# EAGLE design tarjeta-v5 (EAGLE 6.4)
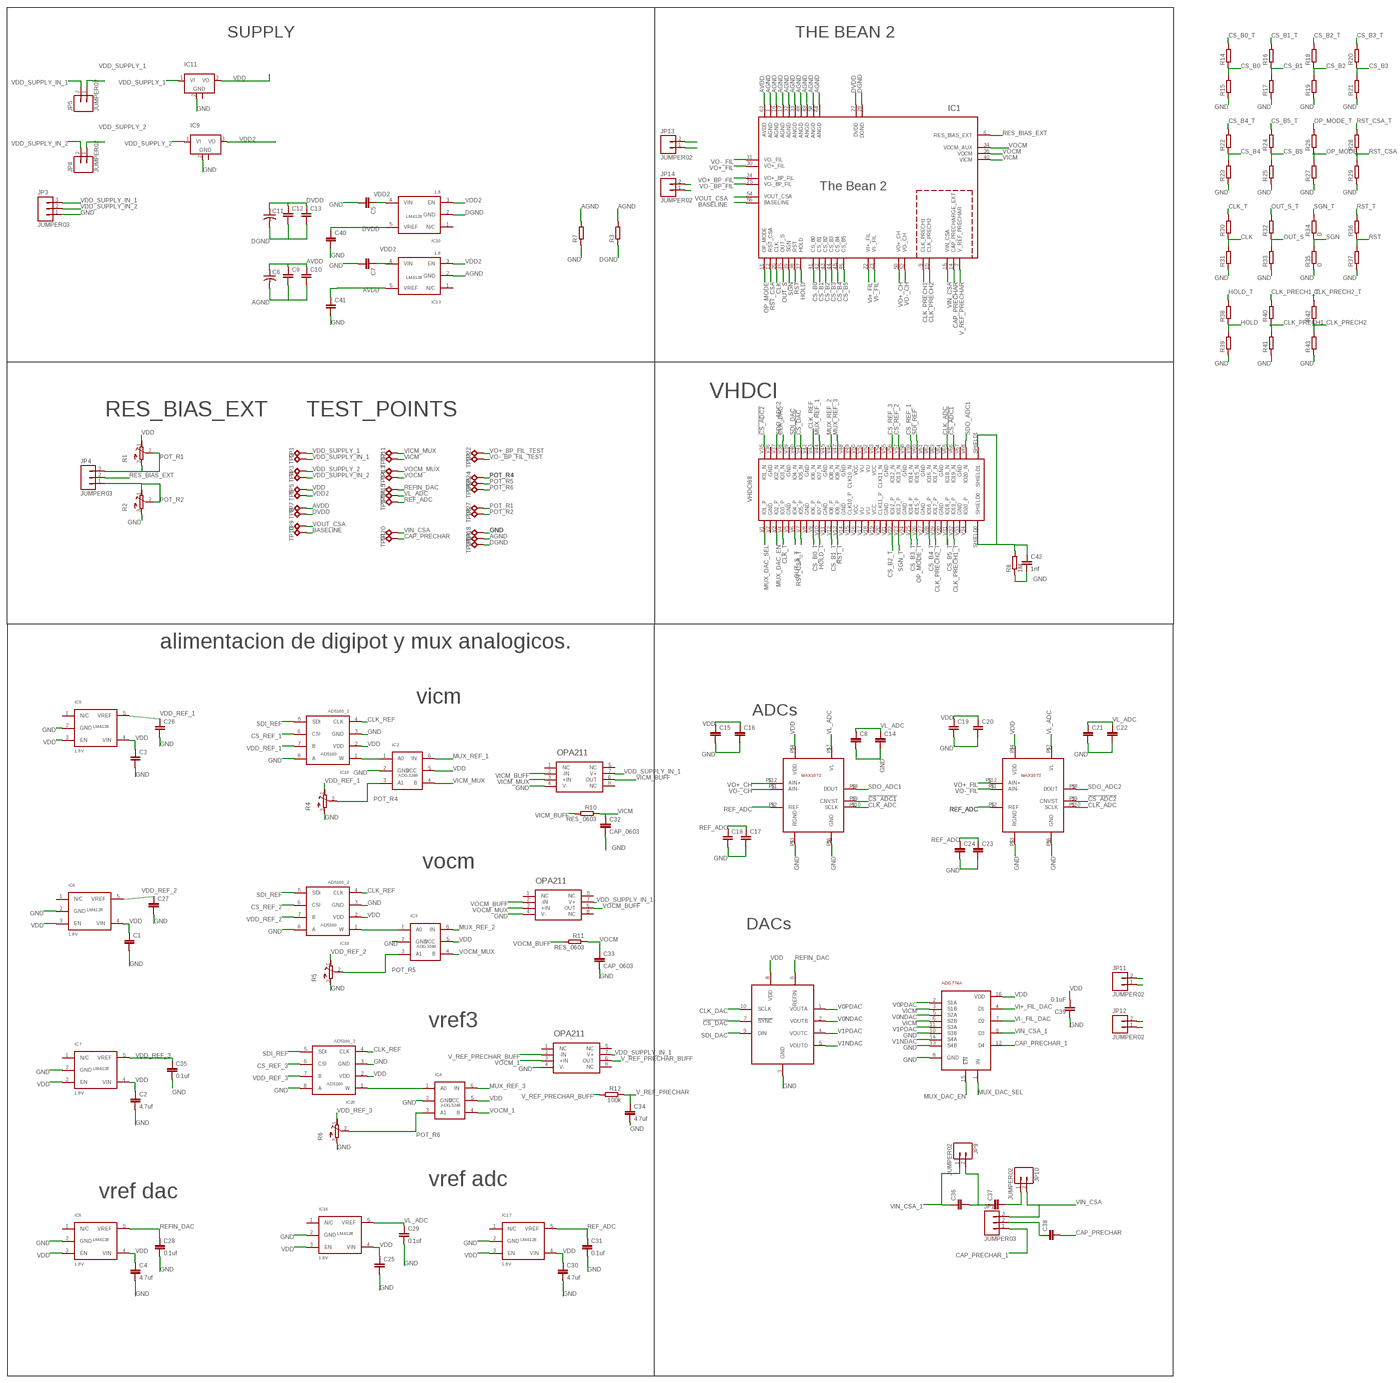
[diagram p0: schematic, sheet 1, overview]
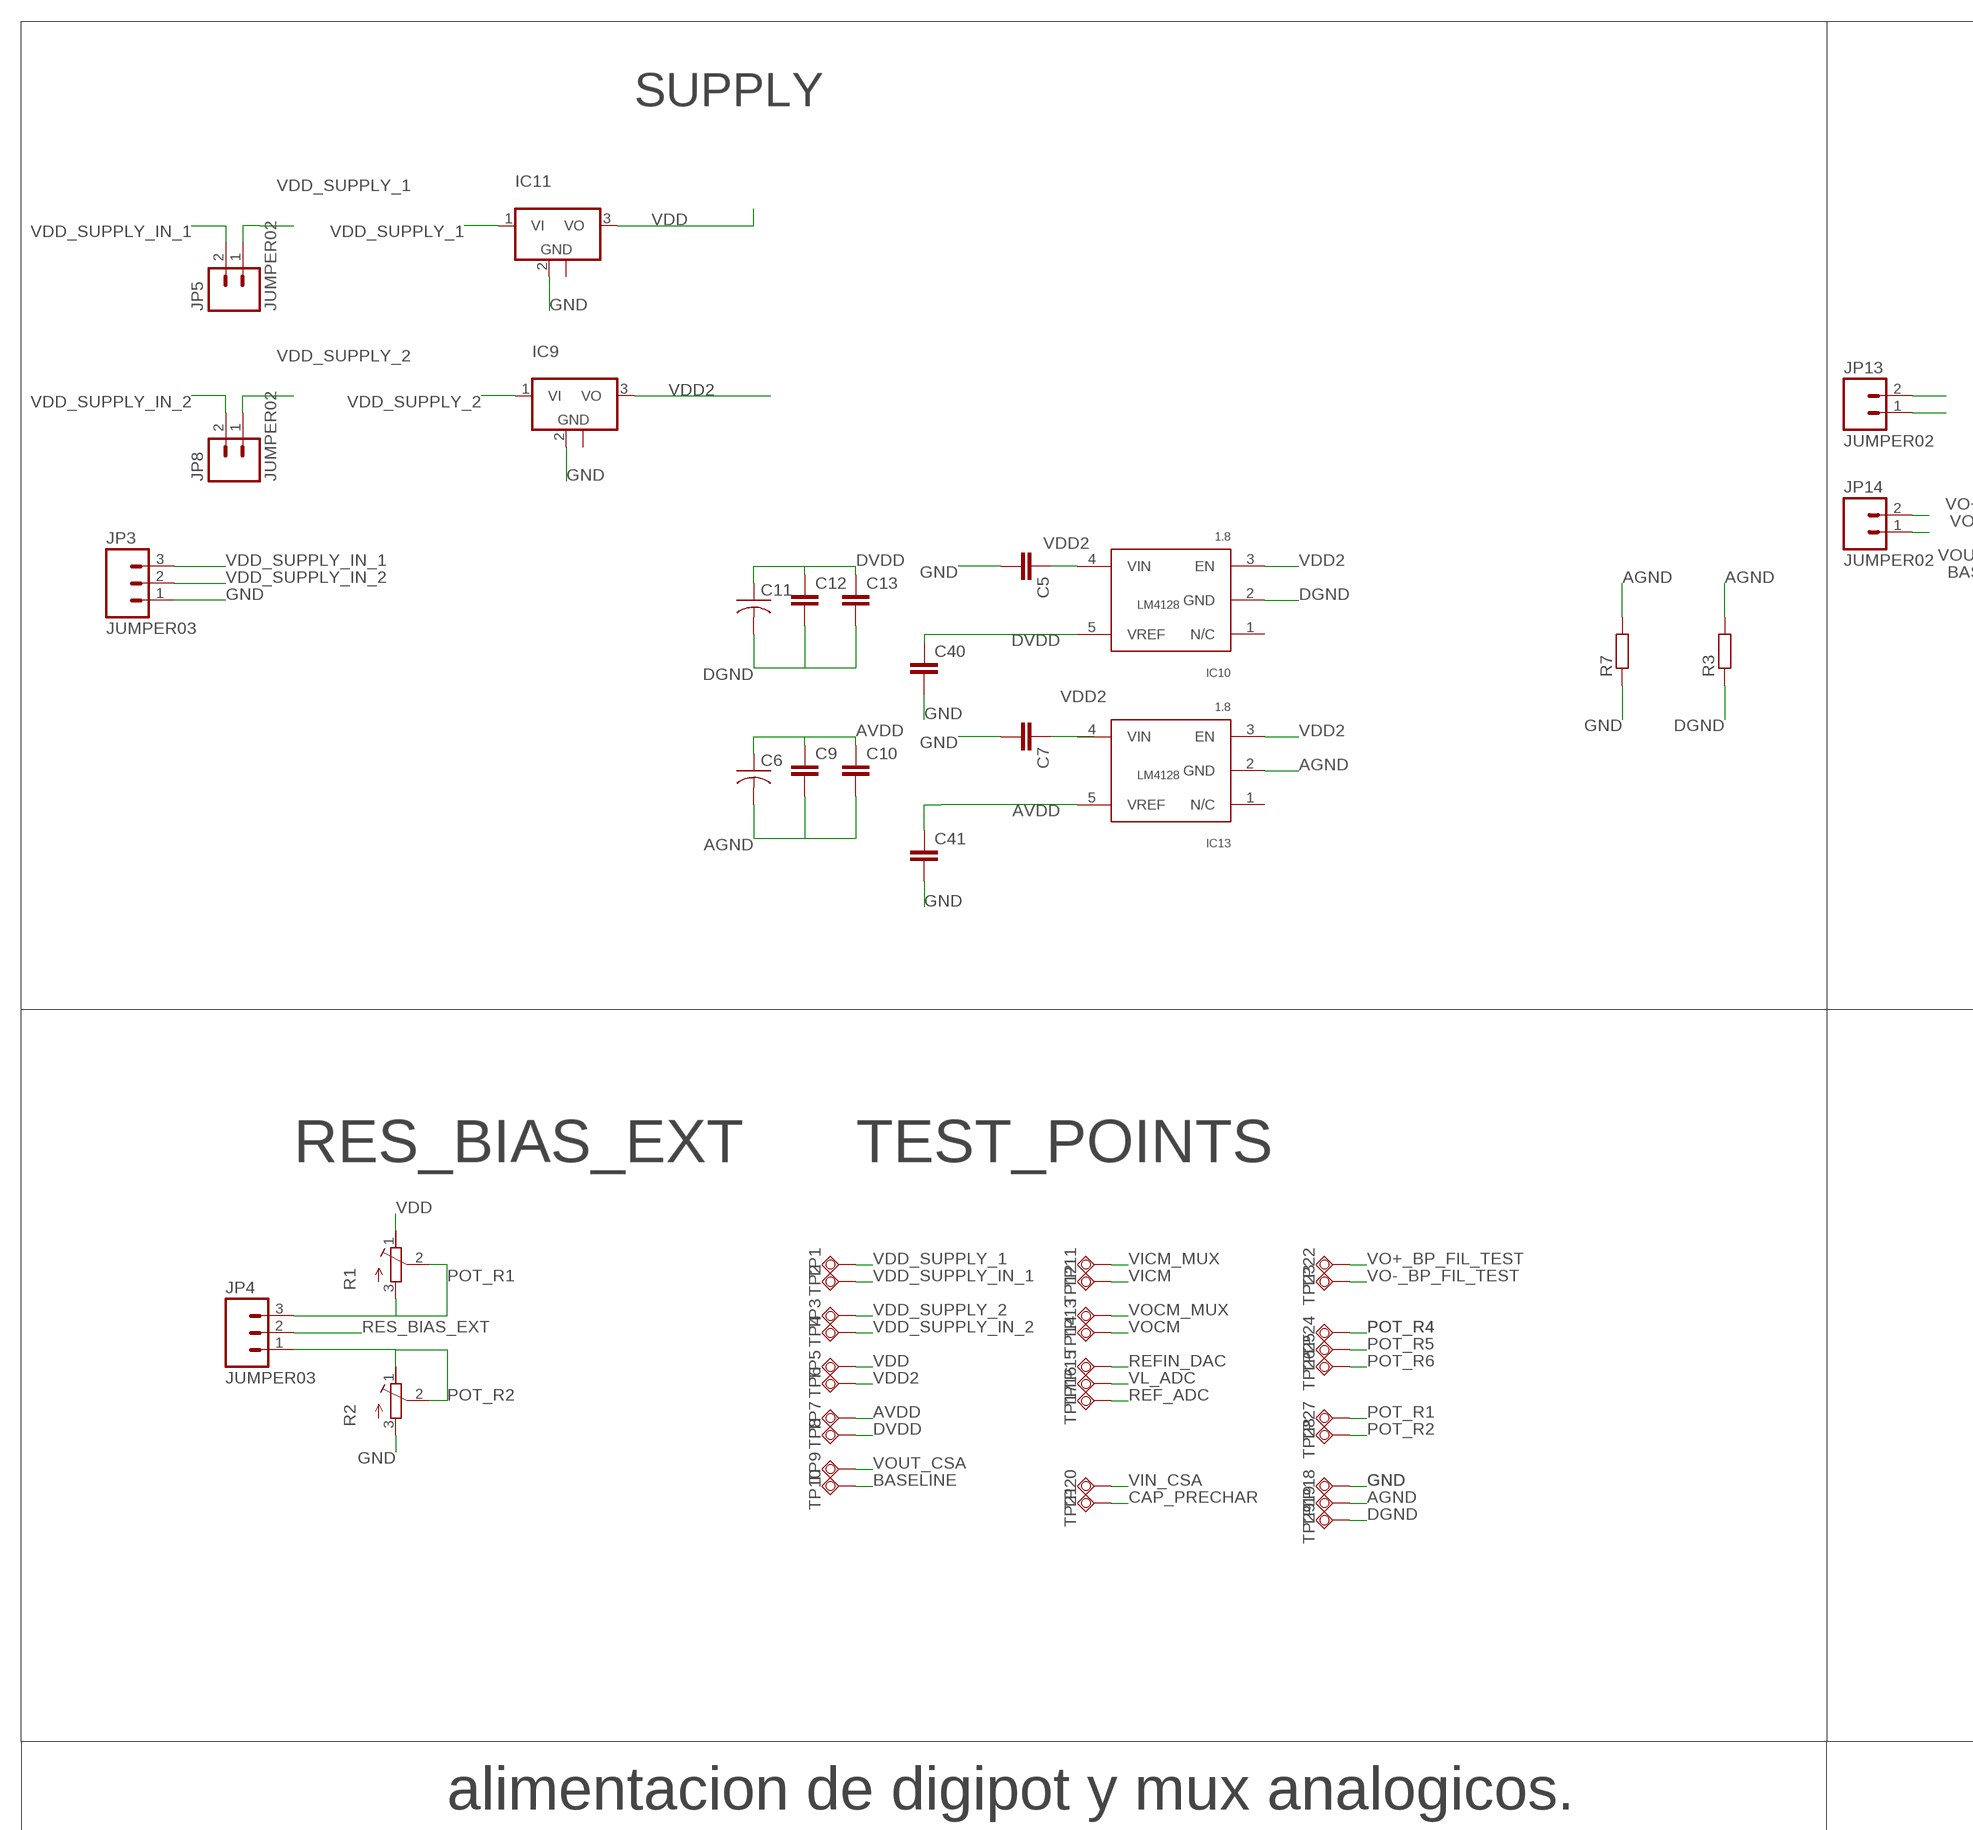
[diagram p1: schematic, sheet 1, part 1 of 4]
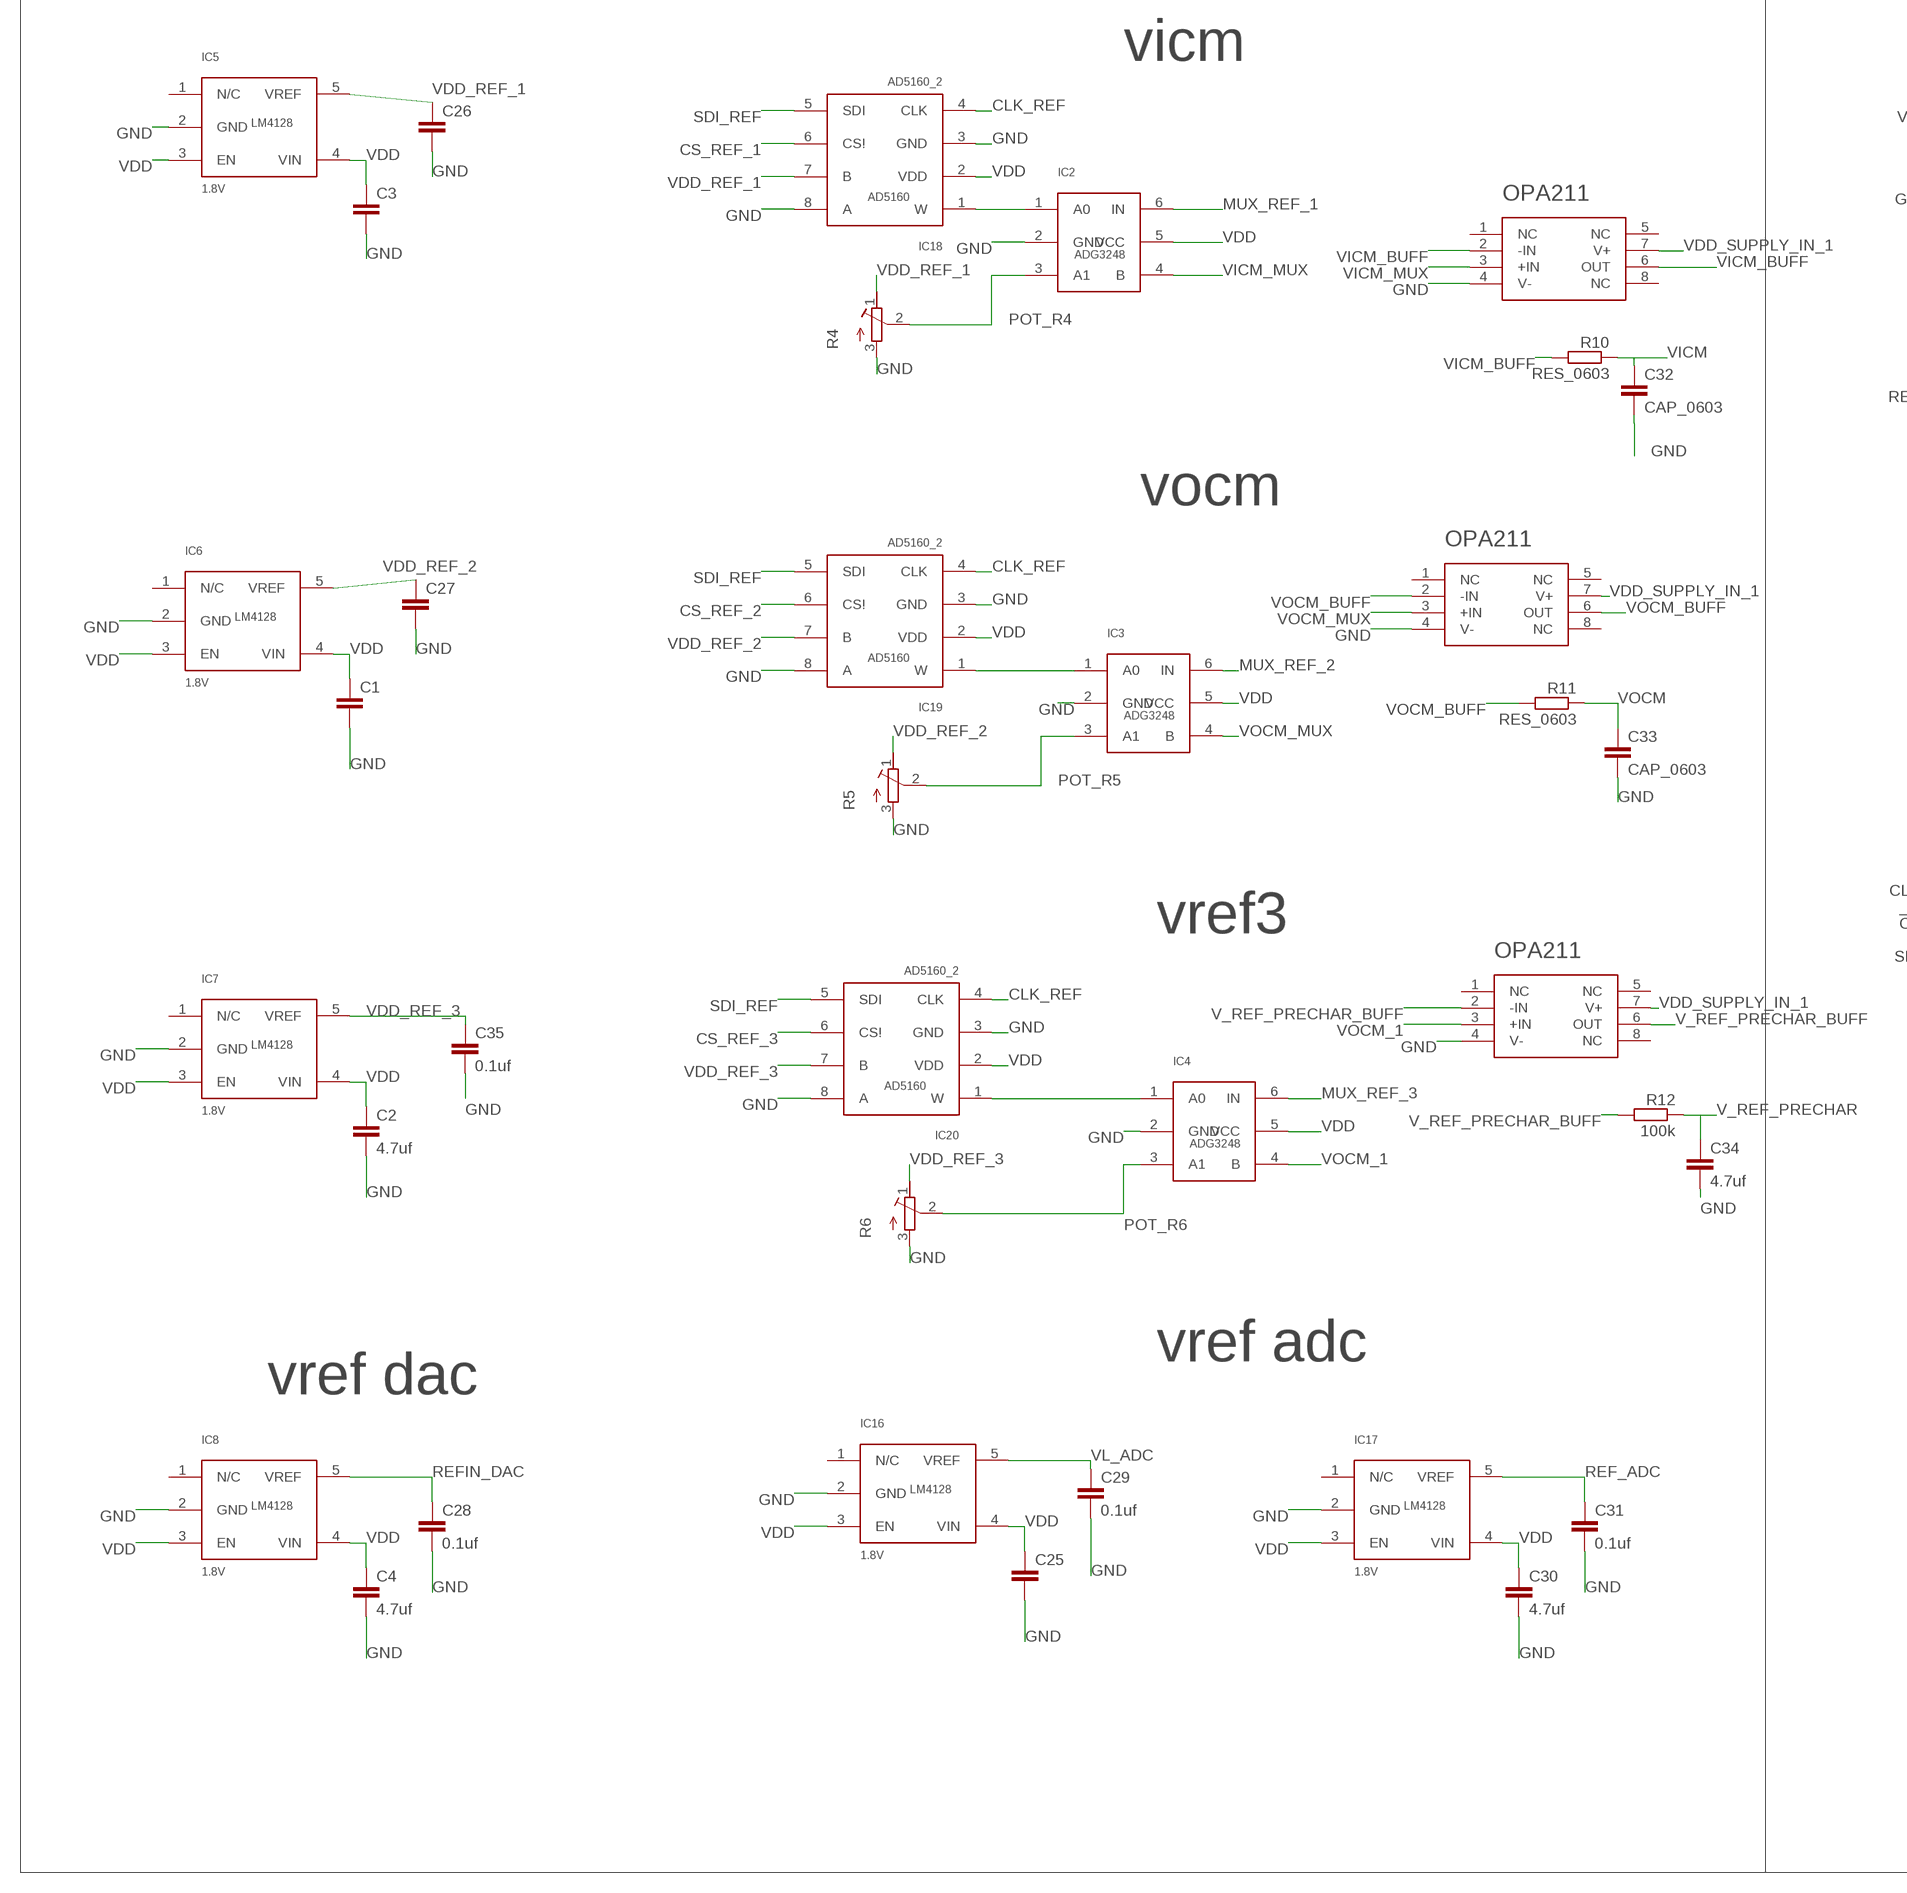
[diagram p2: schematic, sheet 1, part 2 of 4]
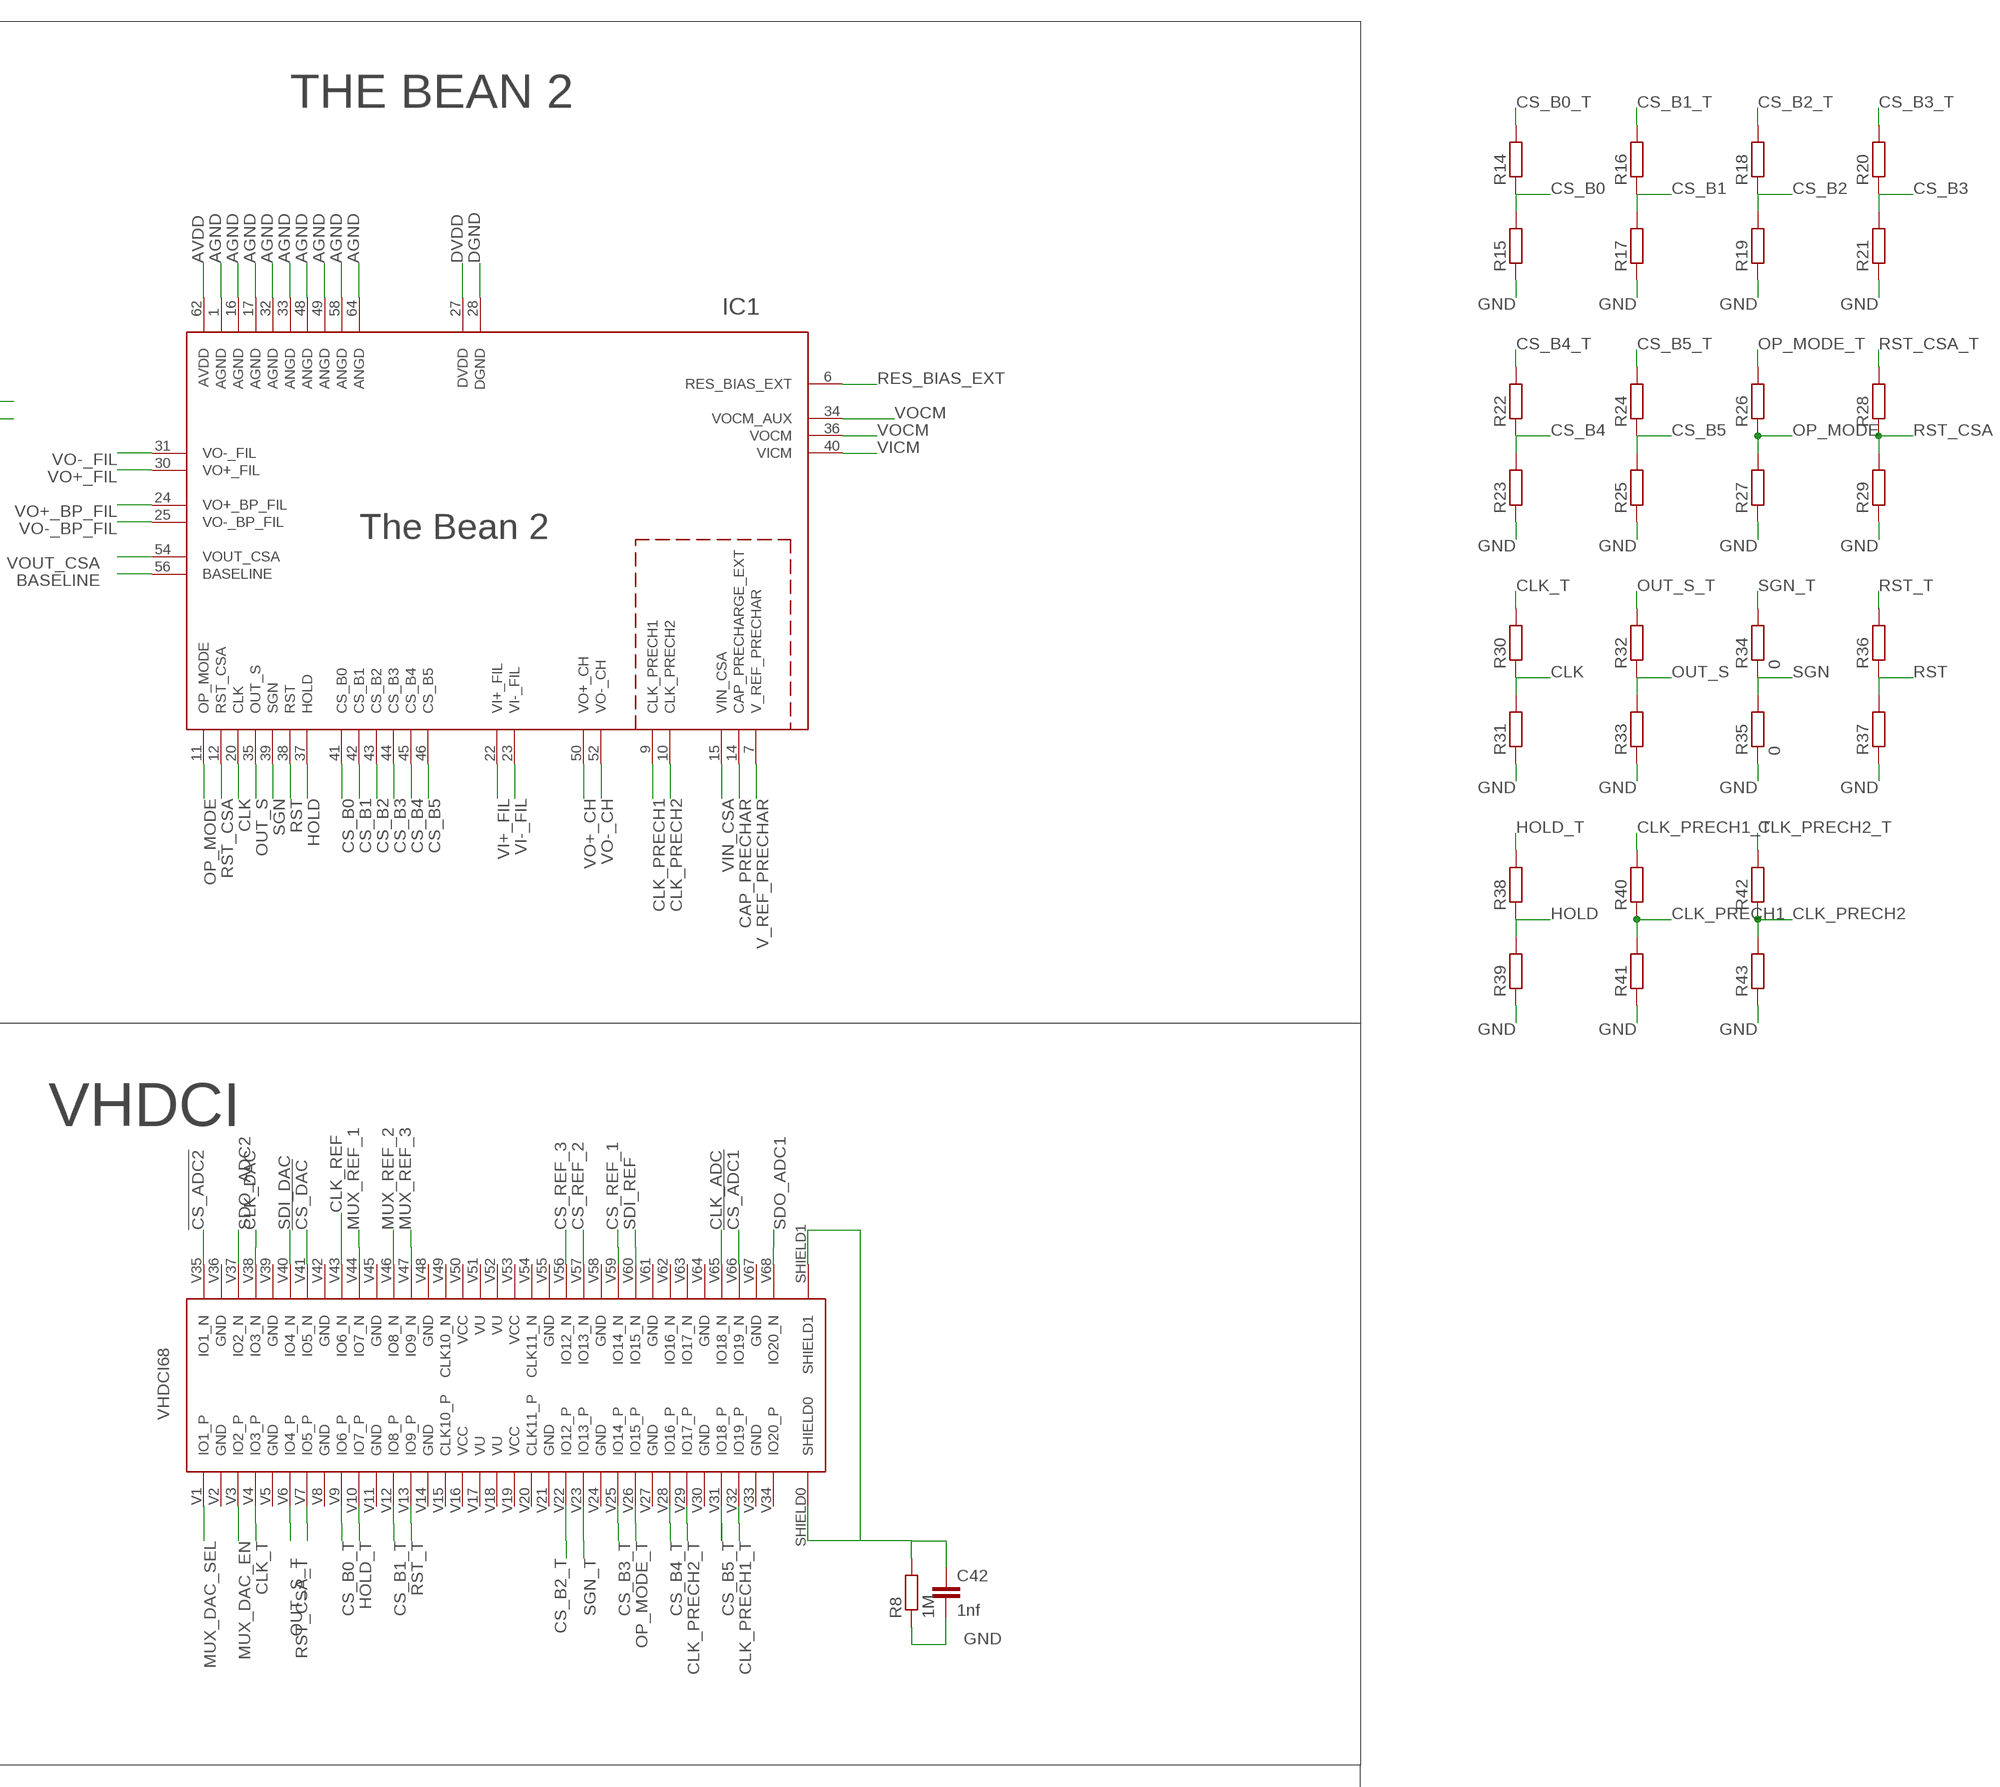
[diagram p3: schematic, sheet 1, part 3 of 4]
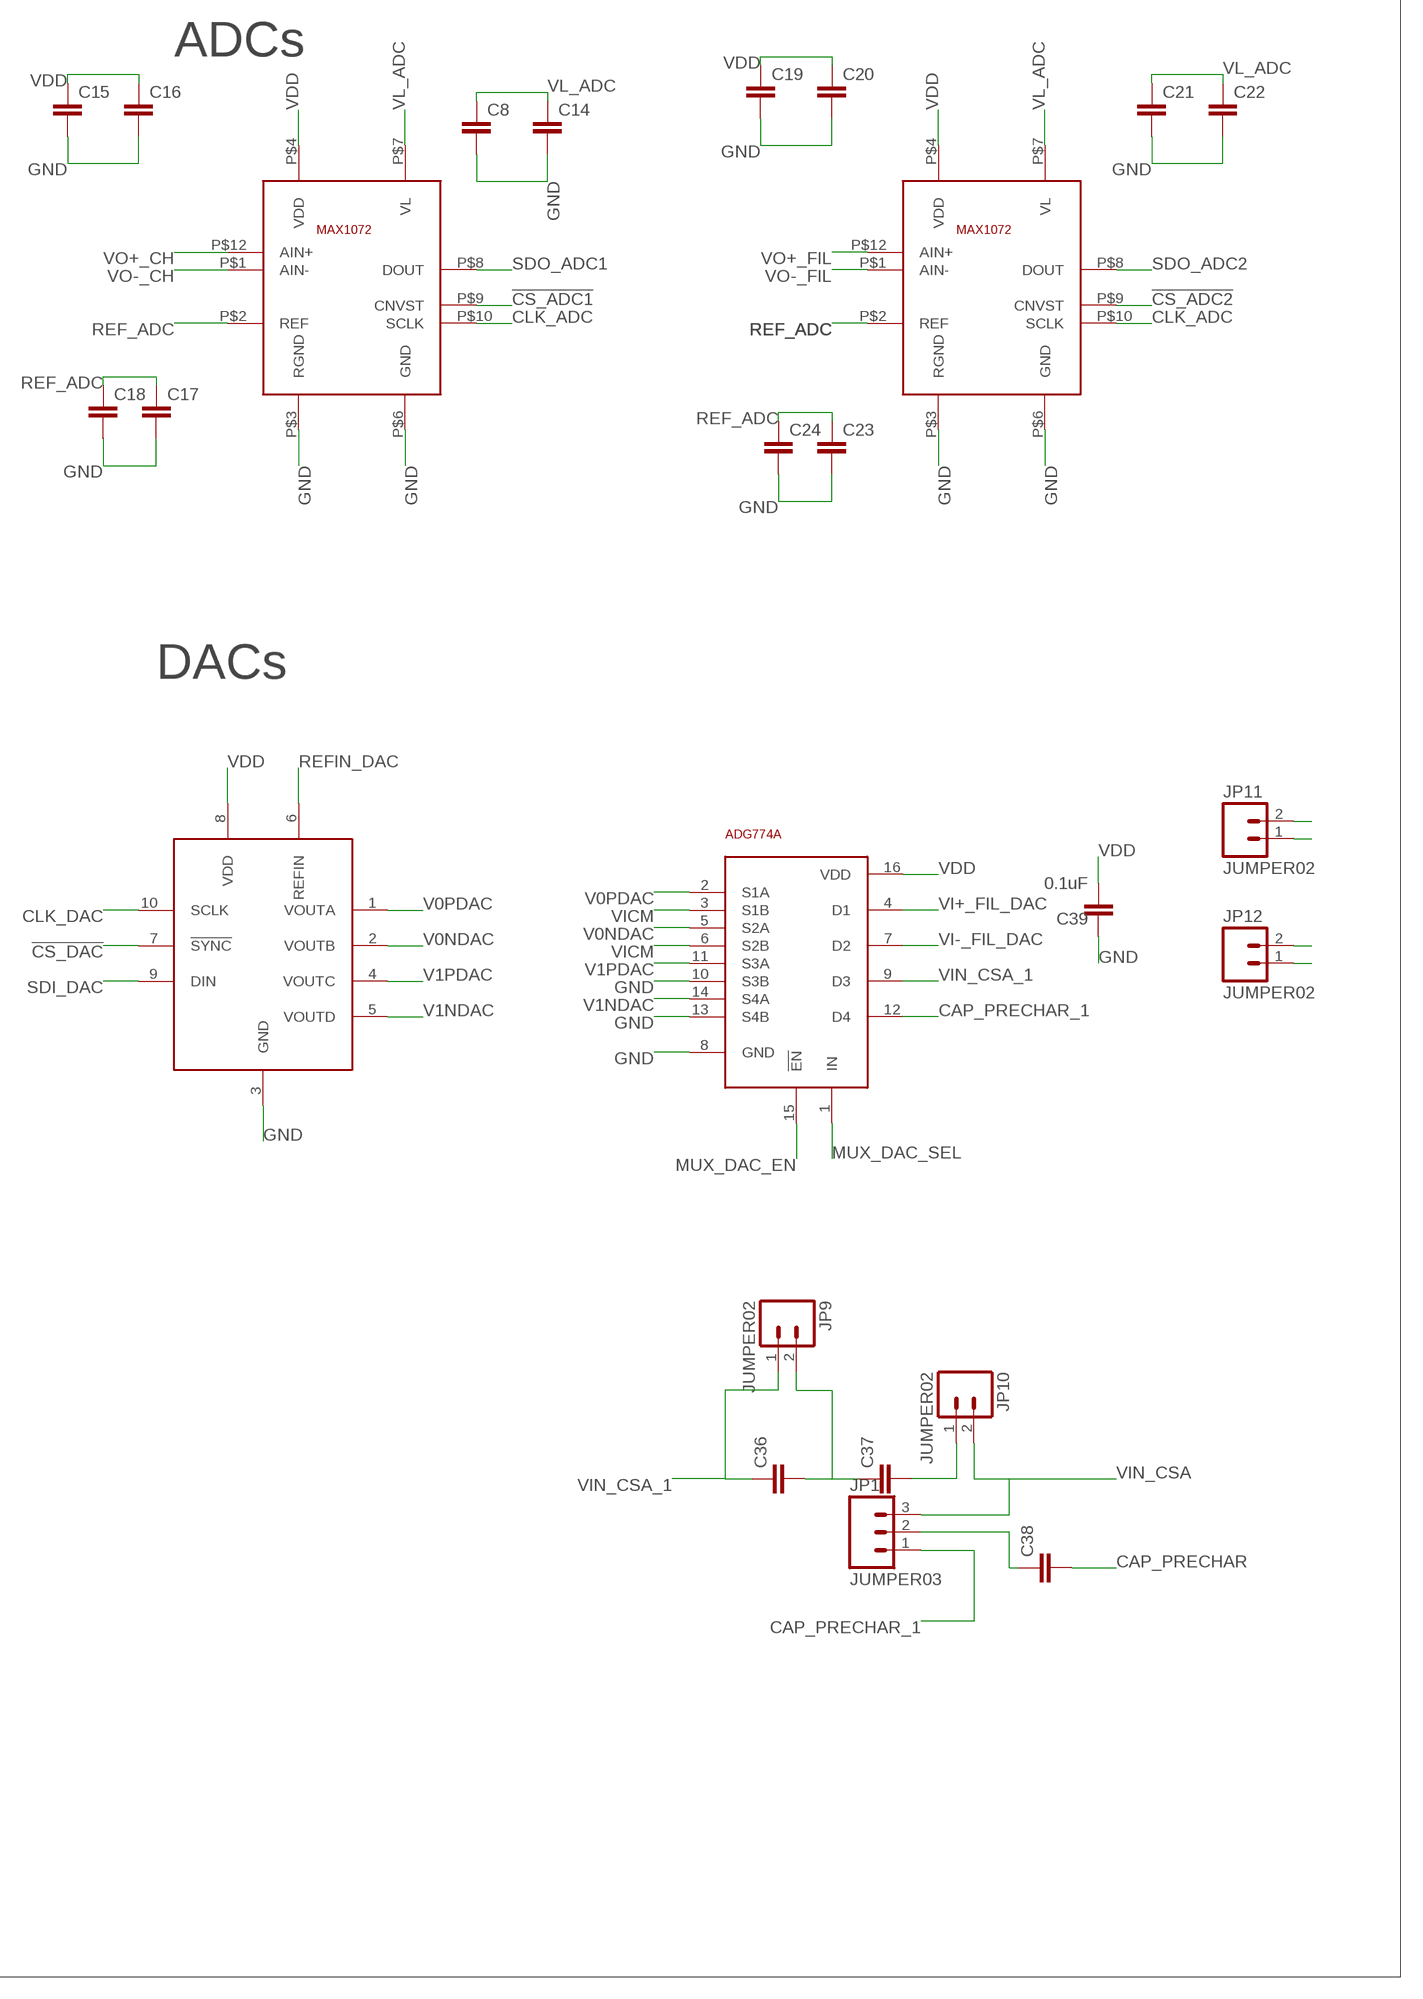
[diagram p4: schematic, sheet 1, part 4 of 4]

## Parts
C1  CAP_0402  [C0402]
C2  4.7uf  CAP_0402  [C0402]
C3  CAP_0402  [C0402]
C4  4.7uf  CAP_0402  [C0402]
C5  CAP_0402  [C0402]
C6  CAP_0805  [C0805]
C7  CAP_0402  [C0402]
C8  CAP_0402  [C0402]
C9  CAP_0402  [C0402]
C10  CAP_0402  [C0402]
C11  CAP_0805  [C0805]
C12  CAP_0402  [C0402]
C13  CAP_0402  [C0402]
C14  CAP_0402  [C0402]
C15  CAP_0402  [C0402]
C16  CAP_0402  [C0402]
C17  CAP_0402  [C0402]
C18  CAP_0402  [C0402]
C19  CAP_0402  [C0402]
C20  CAP_0402  [C0402]
C21  CAP_0402  [C0402]
C22  CAP_0402  [C0402]
C23  CAP_0402  [C0402]
C24  CAP_0402  [C0402]
C25  CAP_0402  [C0402]
C26  CAP_0402  [C0402]
C27  CAP_0402  [C0402]
C28  0.1uf  CAP_0402  [C0402]
C29  0.1uf  CAP_0402  [C0402]
C30  4.7uf  CAP_0402  [C0402]
C31  0.1uf  CAP_0402  [C0402]
C32  CAP_0603  [C0603]
C33  CAP_0603  [C0603]
C34  4.7uf  CAP_0603  [C0603]
C35  0.1uf  CAP_0402  [C0402]
C36  CAP_0402  [C0402]
C37  CAP_0402  [C0402]
C38  CAP_0402  [C0402]
C39  0.1uF  CAP_0402  [C0402]
C40  CAP_0402  [C0402]
C41  CAP_0402  [C0402]
C42  1nf  CAP_0402  [C0402]
IC1  THE_BEAN_2  [QFN64]
IC2  ADG3248  [SC70]
IC3  ADG3248  [SC70]
IC4  ADG3248  [SC70]
IC5  1.8V  LM4128_2  [SOT23-5L_2]
IC6  1.8V  LM4128_2  [SOT23-5L_2]
IC7  1.8V  LM4128_2  [SOT23-5L_2]
IC8  1.8V  LM4128_2  [SOT23-5L_2]
IC9  UA78M33DCY  [SOT223]
IC10  1.8  LM4128_2  [SOT23-5L_2]
IC11  UA78M33DCY  [SOT223]
IC12  OPA211  [SOIC8]
IC13  1.8  LM4128_2  [SOT23-5L_2]
IC14  OPA211  [SOIC8]
IC15  OPA211  [SOIC8]
IC16  1.8V  LM4128_2  [SOT23-5L_2]
IC17  1.8V  LM4128_2  [SOT23-5L_2]
IC18  AD5160_2  [SOT23-8_2]
IC19  AD5160_2  [SOT23-8_2]
IC20  AD5160_2  [SOT23-8_2]
IC21  ADG774A  [QSOP16]
IC22  MAX1072  [TQFN12]
IC23  DAC7554  [MSOP10]
JP1  JUMPER03  [1X03]
JP3  JUMPER03  [1X03]
JP4  JUMPER03  [1X03]
JP5  JUMPER02  [1X02]
JP8  JUMPER02  [1X02]
JP9  JUMPER02  [1X02]
JP10  JUMPER02  [1X02]
JP11  JUMPER02  [1X02]
JP12  JUMPER02  [1X02]
JP13  JUMPER02  [1X02]
JP14  JUMPER02  [1X02]
R1  TRIMMER_ST5  [ST-5EW]
R2  TRIMMER_ST5  [ST-5EW]
R3  RES_0402  [R0402]
R4  TRIMMER_ST5  [ST-5EW]
R5  TRIMMER_ST5  [ST-5EW]
R6  TRIMMER_ST5  [ST-5EW]
R7  RES_0402  [R0402]
R8  1M  RES_0402  [R0402]
R10  RES_0603  [R0603]
R11  RES_0603  [R0603]
R12  100k  RES_0603  [R0603]
R14  R-EU_R0402  [R0402@1]
R15  R-EU_R0402  [R0402@1]
R16  R-EU_R0402  [R0402@1]
R17  R-EU_R0402  [R0402@1]
R18  R-EU_R0402  [R0402@1]
R19  R-EU_R0402  [R0402@1]
R20  R-EU_R0402  [R0402@1]
R21  R-EU_R0402  [R0402@1]
R22  R-EU_R0402  [R0402@1]
R23  R-EU_R0402  [R0402@1]
R24  R-EU_R0402  [R0402@1]
R25  R-EU_R0402  [R0402@1]
R26  R-EU_R0402  [R0402@1]
R27  R-EU_R0402  [R0402@1]
R28  R-EU_R0402  [R0402@1]
R29  R-EU_R0402  [R0402@1]
R30  R-EU_R0402  [R0402@1]
R31  R-EU_R0402  [R0402@1]
R32  R-EU_R0402  [R0402@1]
R33  R-EU_R0402  [R0402@1]
R34  0  R-EU_R0402  [R0402@1]
R35  0  R-EU_R0402  [R0402@1]
R36  R-EU_R0402  [R0402@1]
R37  R-EU_R0402  [R0402@1]
R38  R-EU_R0402  [R0402@1]
R39  R-EU_R0402  [R0402@1]
R40  R-EU_R0402  [R0402@1]
R41  R-EU_R0402  [R0402@1]
R42  R-EU_R0402  [R0402@1]
R43  R-EU_R0402  [R0402@1]
TP1  TEST_POINT  [TP]
TP2  TEST_POINT  [TP]
TP3  TEST_POINT  [TP]
TP4  TEST_POINT  [TP]
TP5  TEST_POINT  [TP]
TP6  TEST_POINT  [TP]
TP7  TEST_POINT  [TP]
TP8  TEST_POINT  [TP]
TP9  TEST_POINT  [TP]
TP10  TEST_POINT  [TP]
TP11  TEST_POINT  [TP]
TP12  TEST_POINT  [TP]
TP13  TEST_POINT  [TP]
TP14  TEST_POINT  [TP]
TP15  TEST_POINT  [TP]
TP16  TEST_POINT  [TP]
TP17  TEST_POINT  [TP]
TP18  TEST_POINT  [TP]
TP19  TEST_POINT  [TP]
TP20  TEST_POINT  [TP]
TP21  TEST_POINT  [TP]
TP22  TEST_POINT  [TP]
TP23  TEST_POINT  [TP]
TP24  TEST_POINT  [TP]
TP25  TEST_POINT  [TP]
TP26  TEST_POINT  [TP]
TP27  TEST_POINT  [TP]
TP28  TEST_POINT  [TP]
TP29  TEST_POINT  [TP]
U$2  VHDCI68  [VHDCI68]
U$5  MAX1072  [TQFN12]

## Nets
!CS_ADC1: IC22.P$9(CNVST) U$2.V66(IO19_N)
!CS_ADC2: U$2.V35(IO1_N) U$5.P$9(CNVST)
!CS_DAC: IC23.7(!SYNC) U$2.V41(IO5_N)
AGND: C6.2 C9.2 C10.2 IC1.1(AGND) IC1.16(AGND) IC1.17(AGND) IC1.32(AGND) IC1.33(ANGD) IC1.48(ANGD) IC1.49(ANGD) IC1.58(ANGD) IC1.64(ANGD) IC13.2(GND) R3.2 R7.2 TP19.TP
AVDD: C6.1 C9.1 C10.1 C41.1 IC1.62(AVDD) IC13.5(VREF) TP7.TP
BASELINE: IC1.56(BASELINE) TP10.TP
CAP_PRECHAR: C38.2 IC1.14(CAP_PRECHARGE_EXT) TP21.TP
CAP_PRECHAR_1: IC21.12(D4) JP1.1
CLK: IC1.20(CLK) R30.1 R31.2
CLK_ADC: IC22.P$10(SCLK) U$2.V65(IO18_N) U$5.P$10(SCLK)
CLK_DAC: IC23.10(SCLK) U$2.V38(IO3_N)
CLK_PRECH1: IC1.9(CLK_PRECH1) R40.1 R41.2
CLK_PRECH1_T: R40.2 U$2.V32(IO19_P)
CLK_PRECH2: IC1.10(CLK_PRECH2) R42.1 R43.2
CLK_PRECH2_T: R42.2 U$2.V29(IO17_P)
CLK_REF: IC18.4(CLK) IC19.4(CLK) IC20.4(CLK) U$2.V43(IO6_N)
CLK_T: R30.2 U$2.V4(IO3_P)
CS_B0: IC1.41(CS_B0) R14.1 R15.2
CS_B0_T: R14.2 U$2.V9(IO6_P)
CS_B1: IC1.42(CS_B1) R16.1 R17.2
CS_B1_T: R16.2 U$2.V12(IO8_P)
CS_B2: IC1.43(CS_B2) R18.1 R19.2
CS_B2_T: R18.2 U$2.V22(IO12_P)
CS_B3: IC1.44(CS_B3) R20.1 R21.2
CS_B3_T: R20.2 U$2.V25(IO14_P)
CS_B4: IC1.45(CS_B4) R22.1 R23.2
CS_B4_T: R22.2 U$2.V28(IO16_P)
CS_B5: IC1.46(CS_B5) R24.1 R25.2
CS_B5_T: R24.2 U$2.V31(IO18_P)
CS_REF_1: IC18.6(CS!) U$2.V59(IO14_N)
CS_REF_2: IC19.6(CS!) U$2.V57(IO13_N)
CS_REF_3: IC20.6(CS!) U$2.V56(IO12_N)
DGND: C11.2 C12.2 C13.2 IC1.28(DGND) IC10.2(GND) R3.1 TP29.TP
DVDD: C11.1 C12.1 C13.1 C40.1 IC1.27(DVDD) IC10.5(VREF) TP8.TP
GND: C1.2 C2.2 C3.2 C4.2 C5.2 C7.2 C8.2 C14.2 C15.2 C16.2 C17.2 C18.2 C19.2 C20.2 C21.2 C22.2 C23.2 C24.2 C25.2 C26.2 C27.2 C28.2 C29.2 C30.2 C31.2 C32.2 C33.2 C34.2 C35.2 C39.1 C40.2 C41.2 C42.2 IC2.2(GND) IC3.2(GND) IC4.2(GND) IC5.2(GND) IC6.2(GND) IC7.2(GND) IC8.2(GND) IC9.2(GND) IC11.2(GND) IC12.4(V-) IC14.4(V-) IC15.4(V-) IC16.2(GND) IC17.2(GND) IC18.3(GND) IC18.8(A) IC19.3(GND) IC19.8(A) IC20.3(GND) IC20.8(A) IC21.8(GND) IC21.10(S3B) IC21.13(S4B) IC22.P$3(RGND) IC22.P$6(GND) IC23.3(GND) JP3.1 R2.3 R4.3 R5.3 R6.3 R7.1 R8.1 R15.1 R17.1 R19.1 R21.1 R23.1 R25.1 R27.1 R29.1 R31.1 R33.1 R35.1 R37.1 R39.1 R41.1 R43.1 TP18.TP U$5.P$3(RGND) U$5.P$6(GND)
HOLD: IC1.37(HOLD) R38.1 R39.2
HOLD_T: R38.2 U$2.V10(IO7_P)
MUX_DAC_EN: IC21.15(!EN) U$2.V3(IO2_P)
MUX_DAC_SEL: IC21.1(IN) U$2.V1(IO1_P)
MUX_REF_1: IC2.6(IN) U$2.V44(IO7_N)
MUX_REF_2: IC3.6(IN) U$2.V46(IO8_N)
MUX_REF_3: IC4.6(IN) U$2.V47(IO9_N)
N$1: C36.2 C37.1 JP9.2
N$3: C37.2 JP10.1
N$5: IC4.1(A0) IC20.1(W)
N$6: C38.1 JP1.2
N$9: C42.1 R8.2 U$2.SHIELD0 U$2.SHIELD1
N$17: IC2.1(A0) IC18.1(W)
N$19: IC3.1(A0) IC19.1(W)
OP_MODE: IC1.11(OP_MODE) R26.1 R27.2
OP_MODE_T: R26.2 U$2.V26(IO15_P)
OUT_S: IC1.35(OUT_S) R32.1 R33.2
OUT_S_T: R32.2 U$2.V6(IO4_P)
POT_R1: JP4.3 R1.2 R1.3 TP27.TP
POT_R2: JP4.1 R2.1 R2.2 TP28.TP
POT_R4: IC2.3(A1) R4.2 TP24.TP
POT_R5: IC3.3(A1) R5.2 TP25.TP
POT_R6: IC4.3(A1) R6.2 TP26.TP
REF_ADC: C17.1 C18.1 C23.1 C24.1 C31.1 IC17.5(VREF) IC22.P$2(REF) TP17.TP U$5.P$2(REF)
REFIN_DAC: C28.1 IC8.5(VREF) IC23.6(REFIN) TP15.TP
RES_BIAS_EXT: IC1.6(RES_BIAS_EXT) JP4.2
RST: IC1.38(RST) R36.1 R37.2
RST_CSA: IC1.12(RST_CSA) R28.1 R29.2
RST_CSA_T: R28.2 U$2.V7(IO5_P)
RST_T: R36.2 U$2.V13(IO9_P)
SDI_DAC: IC23.9(DIN) U$2.V40(IO4_N)
SDI_REF: IC18.5(SDI) IC19.5(SDI) IC20.5(SDI) U$2.V60(IO15_N)
SDO_ADC1: IC22.P$8(DOUT) U$2.V68(IO20_N)
SDO_ADC2: U$2.V37(IO2_N) U$5.P$8(DOUT)
SGN: IC1.39(SGN) R34.1 R35.2
SGN_T: R34.2 U$2.V23(IO13_P)
V0NDAC: IC21.5(S2A) IC23.2(VOUTB)
V0PDAC: IC21.2(S1A) IC23.1(VOUTA)
V1NDAC: IC21.14(S4A) IC23.5(VOUTD)
V1PDAC: IC21.11(S3A) IC23.4(VOUTC)
V_REF_PRECHAR: C34.1 IC1.7(V_REF_PRECHAR) R12.1
V_REF_PRECHAR_BUFF: IC15.2(-IN) IC15.6(OUT) R12.2
VDD: C1.1 C2.1 C3.1 C4.1 C15.1 C16.1 C19.1 C20.1 C25.1 C30.1 C39.2 IC2.5(VCC) IC3.5(VCC) IC4.5(VCC) IC5.3(EN) IC5.4(VIN) IC6.3(EN) IC6.4(VIN) IC7.3(EN) IC7.4(VIN) IC8.3(EN) IC8.4(VIN) IC11.3(VO) IC16.3(EN) IC16.4(VIN) IC17.3(EN) IC17.4(VIN) IC18.2(VDD) IC19.2(VDD) IC20.2(VDD) IC21.16(VDD) IC22.P$4(VDD) IC23.8(VDD) R1.1 TP5.TP U$5.P$4(VDD)
VDD2: C5.1 C7.1 IC9.3(VO) IC10.3(EN) IC10.4(VIN) IC13.3(EN) IC13.4(VIN) TP6.TP
VDD_REF_1: C26.1 IC5.5(VREF) IC18.7(B) R4.1
VDD_REF_2: C27.1 IC6.5(VREF) IC19.7(B) R5.1
VDD_REF_3: C35.1 IC7.5(VREF) IC20.7(B) R6.1
VDD_SUPPLY_1: IC11.1(VI) JP5.1 TP1.TP
VDD_SUPPLY_2: IC9.1(VI) JP8.1 TP3.TP
VDD_SUPPLY_IN_1: IC12.7(V+) IC14.7(V+) IC15.7(V+) JP3.3 JP5.2 TP2.TP
VDD_SUPPLY_IN_2: JP3.2 JP8.2 TP4.TP
VI+_FIL: IC1.22(VI+_FIL) JP11.2
VI+_FIL_DAC: IC21.4(D1) JP11.1
VI-_FIL: IC1.23(VI-_FIL) JP12.2
VI-_FIL_DAC: IC21.7(D2) JP12.1
VICM: C32.1 IC1.40(VICM) IC21.3(S1B) IC21.6(S2B) R10.1 TP12.TP
VICM_BUFF: IC12.2(-IN) IC12.6(OUT) R10.2
VICM_MUX: IC2.4(B) IC12.3(+IN) TP11.TP
VIN_CSA: IC1.15(VIN_CSA) JP1.3 JP10.2 TP20.TP
VIN_CSA_1: C36.1 IC21.9(D3) JP9.1
VL_ADC: C8.1 C14.1 C21.1 C22.1 C29.1 IC16.5(VREF) IC22.P$7(VL) TP16.TP U$5.P$7(VL)
VO+_BP_FIL: IC1.24(VO+_BP_FIL) JP13.1
VO+_BP_FIL_TEST: JP13.2 TP22.TP
VO+_CH: IC1.50(VO+_CH) IC22.P$12(AIN+)
VO+_FIL: IC1.30(VO+_FIL) U$5.P$12(AIN+)
VO-_BP_FIL: IC1.25(VO-_BP_FIL) JP14.1
VO-_BP_FIL_TEST: JP14.2 TP23.TP
VO-_CH: IC1.52(VO-_CH) IC22.P$1(AIN-)
VO-_FIL: IC1.31(VO-_FIL) U$5.P$1(AIN-)
VOCM: C33.1 IC1.34(VOCM_AUX) IC1.36(VOCM) R11.1 TP14.TP
VOCM_1: IC4.4(B) IC15.3(+IN)
VOCM_BUFF: IC14.2(-IN) IC14.6(OUT) R11.2
VOCM_MUX: IC3.4(B) IC14.3(+IN) TP13.TP
VOUT_CSA: IC1.54(VOUT_CSA) TP9.TP
Unconnected: IC5.1(N/C) IC6.1(N/C) IC7.1(N/C) IC8.1(N/C) IC9.4(GND) IC10.1(N/C) IC11.4(GND) IC12.1(NC) IC12.5(NC) IC12.8(NC) IC13.1(N/C) IC14.1(NC) IC14.5(NC) IC14.8(NC) IC15.1(NC) IC15.5(NC) IC15.8(NC) IC16.1(N/C) IC17.1(N/C) U$2.V2(GND) U$2.V5(GND) U$2.V8(GND) U$2.V11(GND) U$2.V14(GND) U$2.V15(CLK10_P) U$2.V20(CLK11_P) U$2.V21(GND) U$2.V24(GND) U$2.V27(GND) U$2.V30(GND) U$2.V33(GND) U$2.V34(IO20_P) U$2.V36(GND) U$2.V39(GND) U$2.V42(GND) U$2.V45(GND) U$2.V48(GND) U$2.V49(CLK10_N) U$2.V54(CLK11_N) U$2.V55(GND) U$2.V58(GND) U$2.V61(GND) U$2.V62(IO16_N) U$2.V63(IO17_N) U$2.V64(GND) U$2.V67(GND)

## Notes on the sheet
- SUPPLY | THE BEAN 2
- VHDCI
- RES_BIAS_EXT | TEST_POINTS
- alimentacion de digipot y mux analogicos.
- vicm
- ADCs
- vocm
- DACs
- vref3
- vref adc
- vref dac

## Power pins joined to a net without a drawn wire
VCC: U$2.V16(VCC) U$2.V19(VCC) U$2.V50(VCC) U$2.V53(VCC)
VU: U$2.V17(VU) U$2.V18(VU) U$2.V51(VU) U$2.V52(VU)

## Library data of the parts
C1-C5 C7-C10 C12-C31 C35-C42 = wac:CAP_0402
C6 C11 = wac:CAP_0805
C32-C34 = wac:CAP_0603
IC1 = wac:THE_BEAN_2
IC2-IC4 = wac:ADG3248
IC5-IC8 IC10 IC13 IC16 IC17 = wac:LM4128_2
IC9 IC11 = linear:UA78M*: POSITIVE-VOLTAGE REGULATORS Source: http://focus.ti.com/lit/ds/symlink/ua78m33.pdf
IC12 IC14 IC15 = wac:OPA211
IC18-IC20 = wac:AD5160_2
IC21 = wac:ADG774A: Low voltage,400MHz, Quad 2:1 MUX with 3ns Switching Time http://www.analog.com/static/imported-files/data_sheets/ADG774A.pdf
IC22 U$5 = wac:MAX1072
IC23 = wac:DAC7554: 12-BIT, QUAD, ULTRALOW GLITCH, VOLTAGE OUTPUT DIGITAL-TO-ANALOG CONVERTER http://www.ti.com/lit/ds/symlink/dac7554.pdf
JP1 JP3 JP4 = wac:JUMPER03
JP5 JP8-JP14 = wac:JUMPER02
R1 R2 R4-R6 = wac:TRIMMER_ST5
R3 R7 R8 = wac:RES_0402
R10-R12 = wac:RES_0603
R14-R43 = rcl:R-EU_: RESISTOR, European symbol
TP1-TP29 = wac:TEST_POINT
U$2 = tw:VHDCI68: Nexys 3 VHDCI 68pin 0.8mm pitch

## Board
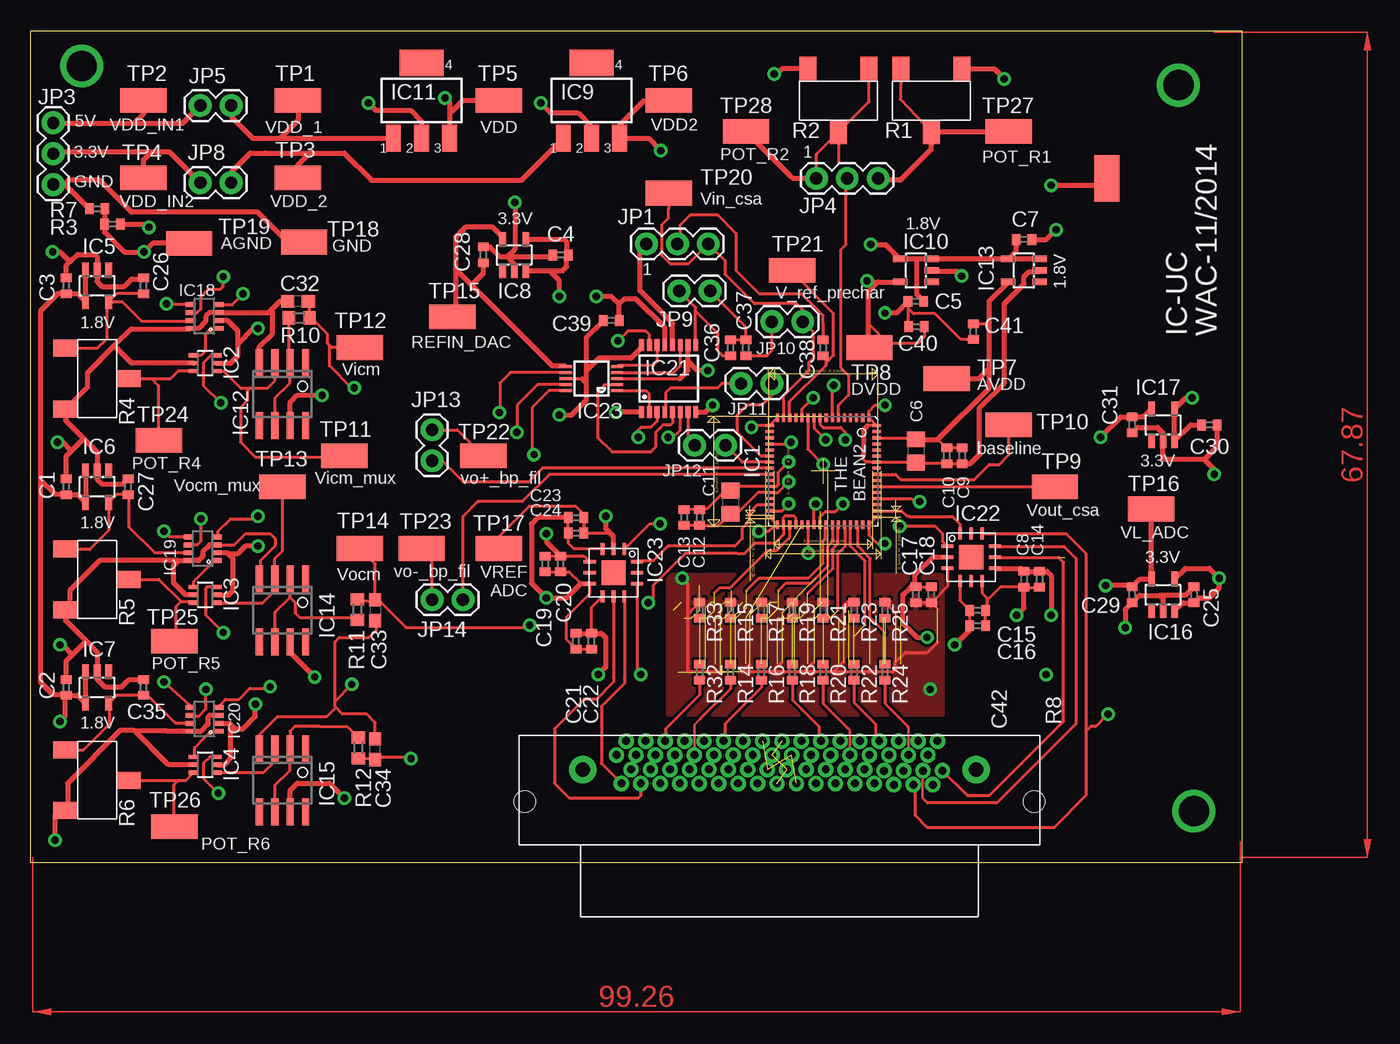
[diagram p5: board, top side]
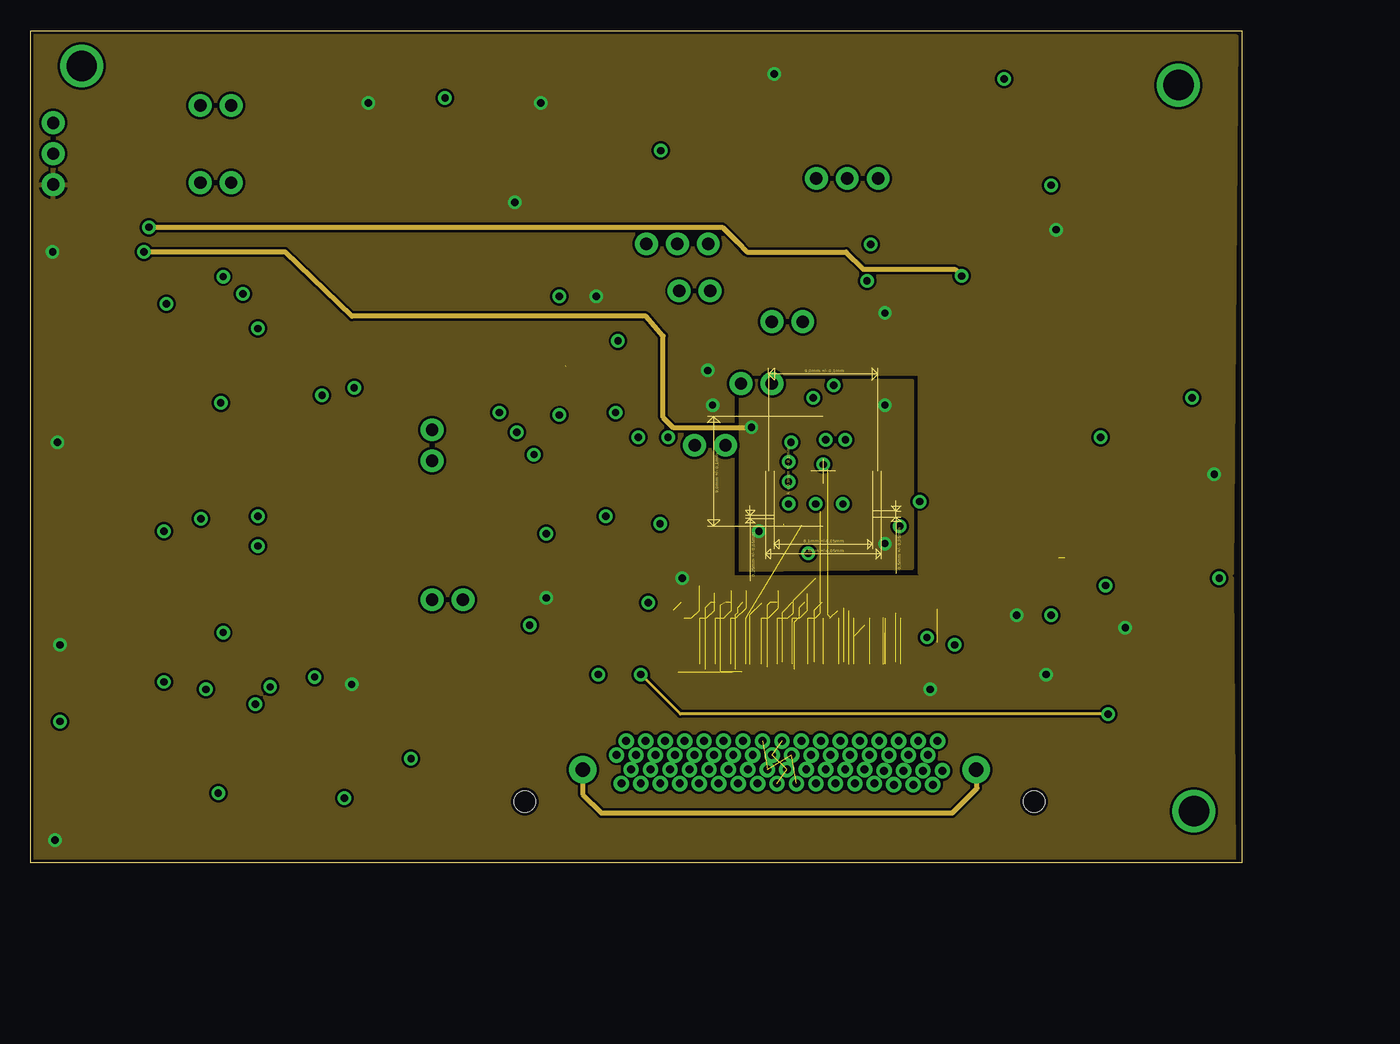
[diagram p6: board, inner layer Route2]
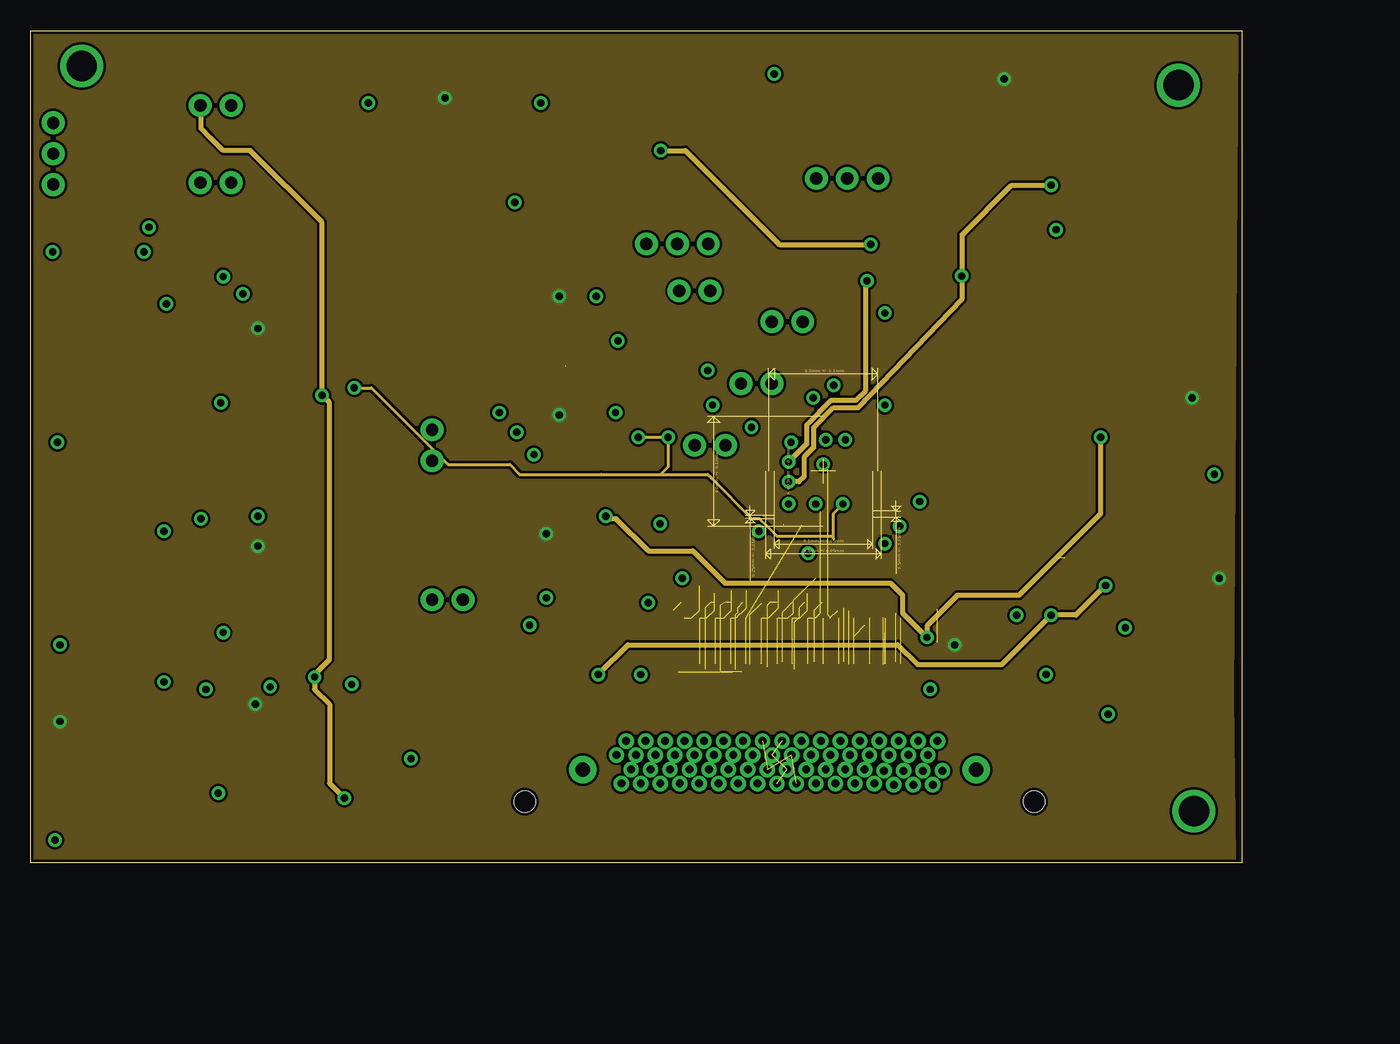
[diagram p7: board, inner layer Route3]
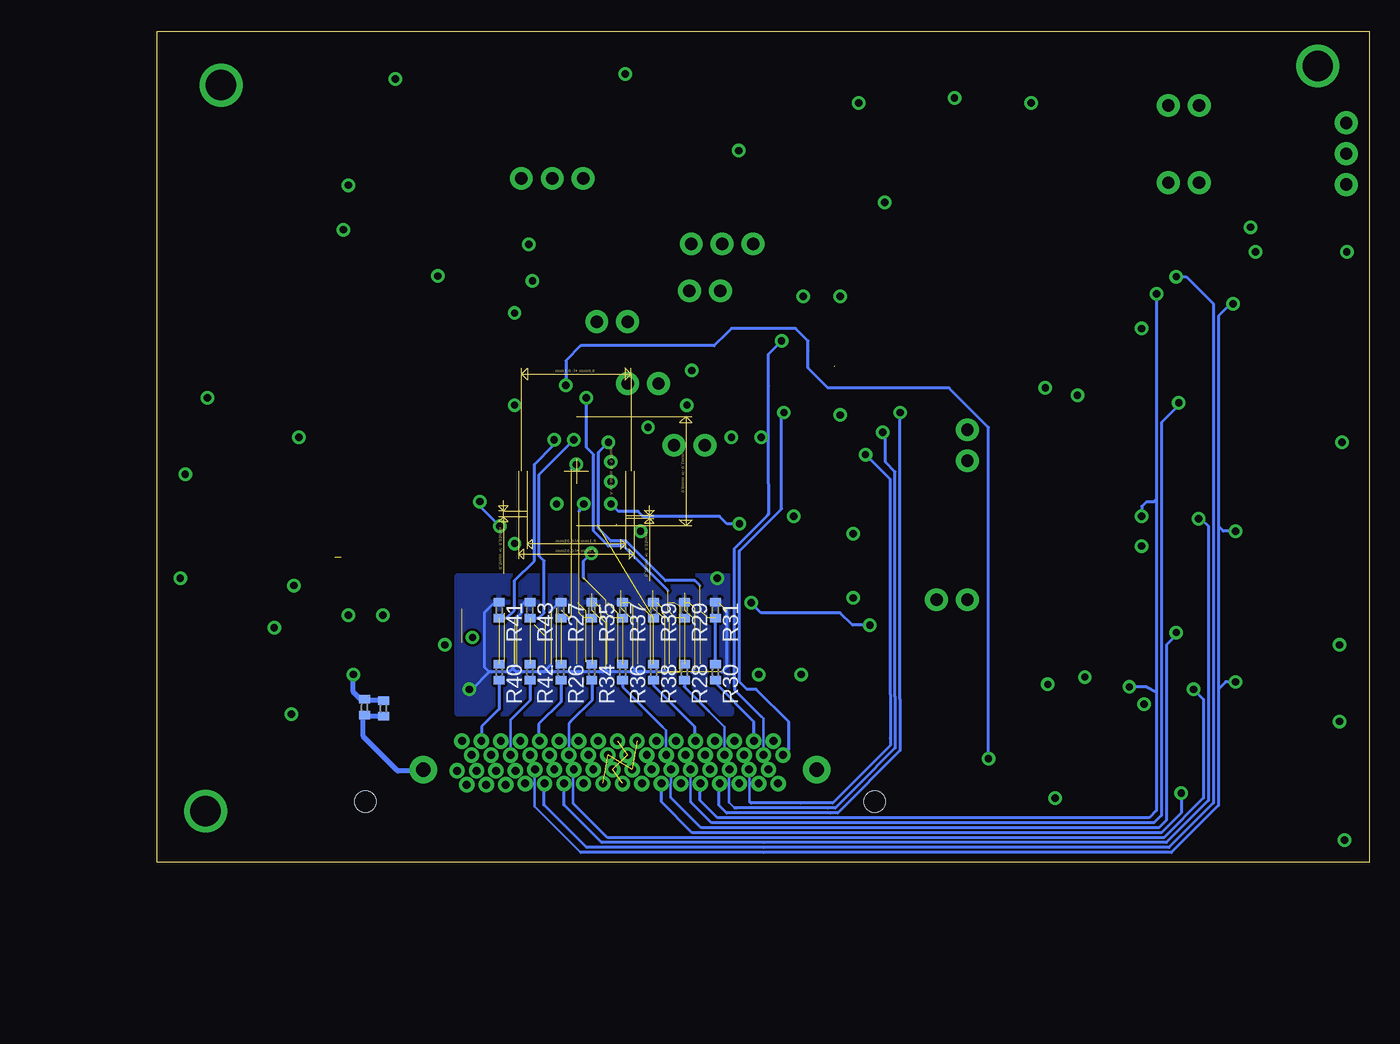
[diagram p8: board, bottom side, seen from below]

Size 99.65 x 68.35 mm. Coordinates in mm from the lower left corner, seen from the top.
Outline: 0,0 99.65,0 99.65,68.35 0,68.35 0,0
Copper layers [2:(1*2*3*16):3]: Top 0.035mm / dielectric 0.2mm / Route2 0.035mm / dielectric 0.8mm / Route3 0.035mm / dielectric 0.2mm / Bottom 0.035mm
Design rules "SparkFun": minimum track width 8mil, minimum drill 20mil, track to track 8mil, track to pad 8mil, pad to pad 8mil, via to via 8mil, smd to smd 8mil, copper to edge 10mil, drill to drill 8mil, minimum pad ring 12mil, minimum via ring 10mil, stop-mask expansion 4mil, vias tented up to drill 25mil, thermal gap 10mil

### Footprints (pad centres in the part's own frame; a part is rotated, then mirrored left to right if it is on the bottom)
C0402 = smd 0.7 x 0.9: 1 -0.65,0; 2 0.65,0
C0805 = smd 1.3 x 1.5: 1 -0.95,0; 2 0.95,0
C0603 = smd 1.1 x 1: 1 -0.85,0; 2 0.85,0
QFN64 = smd 0.7 x 0.25: 1 -14.56,5.02; 2 -14.56,4.52; 3 -14.56,4.02; 4 -14.56,3.52; 5 -14.56,3.02; 6 -14.56,2.52; 7 -14.56,2.02; 8 -14.56,1.52; 9 -14.56,1.02; 10 -14.56,0.52; 11 -14.56,0.02; 12 -14.56,-0.48; 13 -14.56,-0.98; 14 -14.56,-1.48; 15 -14.56,-1.98; 16 -14.56,-2.48; 33 -5.76,-2.48; 34 -5.76,-1.98; 35 -5.76,-1.48; 36 -5.76,-0.98; 37 -5.76,-0.48; 38 -5.76,0.02; 39 -5.76,0.52; 40 -5.76,1.02; 41 -5.76,1.52; 42 -5.76,2.02; 43 -5.76,2.52; 44 -5.76,3.02; 45 -5.76,3.52; 46 -5.76,4.02; 47 -5.76,4.52; 48 -5.76,5.02 | smd 0.25 x 0.7: 17 -13.91,-3.13; 18 -13.41,-3.13; 19 -12.91,-3.13; 20 -12.41,-3.13; 21 -11.91,-3.13; 22 -11.41,-3.13; 23 -10.91,-3.13; 24 -10.41,-3.13; 25 -9.91,-3.13; 26 -9.41,-3.13; 27 -8.91,-3.13; 28 -8.41,-3.13; 29 -7.91,-3.13; 30 -7.41,-3.13; 31 -6.91,-3.13; 32 -6.41,-3.13; 49 -6.41,5.67; 50 -6.91,5.67; 51 -7.41,5.67; 52 -7.91,5.67; 53 -8.41,5.67; 54 -8.91,5.67; 55 -9.41,5.67; 56 -9.91,5.67; 57 -10.41,5.67; 58 -10.91,5.67; 59 -11.41,5.67; 60 -11.91,5.67; 61 -12.41,5.67; 62 -12.91,5.67; 63 -13.41,5.67; 64 -13.91,5.67
SC70 = smd 0.35 x 0.8: 1 -0.65,-0.95; 2 0,-0.95; 3 0.65,-0.95; 4 0.65,0.95; 5 0,0.95; 6 -0.65,0.95
SOT23-5L_2 = smd 0.55 x 1.2: 1 -0.95,-1.3; 2 0,-1.3; 3 0.95,-1.3; 4 0.95,1.3; 5 -0.95,1.3
SOT223 = smd 1.219 x 2.235: 1 -2.311,-3.099; 2 0,-3.099; 3 2.311,-3.099 | smd 3.6 x 2.2: 4 0,3.099
SOIC8 = smd 0.6 x 2.2: 1 -1.905,-2.6; 2 -0.635,-2.6; 3 0.635,-2.6; 4 1.905,-2.6; 5 1.905,2.6; 6 0.635,2.6; 7 -0.635,2.6; 8 -1.905,2.6
SOT23-8_2 = smd 0.406 x 0.813: 1 -1,-1.04; 2 -0.35,-1.04; 3 0.3,-1.04; 4 0.95,-1.04; 5 0.95,1.26; 6 0.3,1.26; 7 -0.35,1.26; 8 -1,1.26
QSOP16 = smd 0.4 x 1: 1 -2.223,-2.75; 2 -1.588,-2.75; 3 -0.953,-2.75; 4 -0.318,-2.75; 5 0.318,-2.75; 6 0.953,-2.75; 7 1.588,-2.75; 8 2.223,-2.75; 9 2.223,2.75; 10 1.588,2.75; 11 0.953,2.75; 12 0.318,2.75; 13 -0.318,2.75; 14 -0.953,2.75; 15 -1.588,2.75; 16 -2.223,2.75
TQFN12 = smd 1 x 0.3: P$1 0.05,-1.1; P$2 0.05,-2; P$3 0.05,-2.9; P$7 3.95,-2.9; P$8 3.95,-2; P$9 3.95,-1.1 | smd 0.3 x 1: P$4 1.1,-3.95; P$5 2,-3.95; P$6 2.9,-3.95; P$10 2.9,-0.05; P$11 2,-0.05; P$12 1.1,-0.05 | smd 2 x 2: P$13 2,-2
MSOP10 = smd 0.25 x 1: 1 -1,-2.113; 2 -0.5,-2.113; 3 0,-2.113; 4 0.5,-2.113; 5 1,-2.113; 6 1,2.113; 7 0.5,2.113; 8 0,2.113; 9 -0.5,2.113; 10 -1,2.113
1X03 = drill 1.016 pad 1.88: 1 -2.54,0; 2 0,0; 3 2.54,0
1X02 = drill 1.016 pad 1.88: 1 -1.27,0; 2 1.27,0
ST-5EW = smd 1.4 x 2: 1 -2.5,-2.6; 2 0,2.6; 3 2.5,-2.6
R0402 = smd 0.7 x 0.9: 1 -0.65,0; 2 0.65,0
R0603 = smd 1 x 1.1: 1 -0.85,0; 2 0.85,0
TP = smd 3.81 x 2.032: TP 0,0
VHDCI68 = drill 1.2 pad 2.25: SHIELD0 18.375,-0.4; SHIELD1 -13.975,-0.4 | drill 0.65 pad 1: V1 -11.2,0.8; V2 -10.4,1.95; V3 -9.6,0.8; V4 -8.8,1.95; V5 -8,0.8; V6 -7.2,1.95; V7 -6.4,0.8; V8 -5.6,1.95; V9 -4.8,0.8; V10 -4,1.95; V11 -3.2,0.8; V12 -2.4,1.95; V13 -1.6,0.8; V14 -0.8,1.95; V15 0,0.8; V16 0.8,1.95; V17 1.6,0.8; V18 2.4,1.95; V19 3.2,0.8; V20 4,1.95; V21 4.8,0.8; V22 5.6,1.95; V23 6.4,0.8; V24 7.2,1.95; V25 8,0.8; V26 8.8,1.95; V27 9.6,0.8; V28 10.4,1.95; V29 11.2,0.8; V30 12,1.95; V31 12.8,0.8; V32 13.6,1.95; V33 14.4,0.8; V34 15.2,1.95; V35 -10.8,-1.55; V36 -10,-0.4; V37 -9.2,-1.55; V38 -8.4,-0.4; V39 -7.6,-1.55; V40 -6.8,-0.4; V41 -6,-1.55; V42 -5.2,-0.4; V43 -4.4,-1.55; V44 -3.6,-0.4; V45 -2.8,-1.55; V46 -2,-0.4; V47 -1.2,-1.55; V48 -0.4,-0.4; V49 0.4,-1.55; V50 1.2,-0.4; V51 2,-1.55; V52 2.8,-0.4; V53 3.6,-1.55; V54 4.4,-0.4; V55 5.2,-1.55; V56 6,-0.4; V57 6.8,-1.55; V58 7.6,-0.4; V59 8.4,-1.55; V60 9.2,-0.4; V61 10,-1.55; V62 10.8,-0.5; V63 11.6,-1.65; V64 12.4,-0.5; V65 13.2,-1.65; V66 14,-0.5; V67 14.8,-1.65; V68 15.6,-0.5 | hole 1.75: -18.75,-3.025; 23.15,-3.025

### Placement (x,y rotation side)
C1  2.95,30.89 90 top
C2  2.95,14.38 90 top
C3  2.95,47.4 90 top
C4  43.59,49.94 180 top
C5  72.8,46.13 180 top
C6  72.8,33.83 270 top
C7  81.69,51.21 0 top
C8  82.96,23.27 270 top
C9  76.61,33.43 270 top
C10  75.34,33.43 270 top
C11  57.56,29.62 270 top
C12  55.02,28.35 270 top
C13  53.75,28.35 270 top
C14  81.69,23.27 270 top
C15  77.88,20.73 0 top
C16  77.88,19.46 0 top
C17  72.8,22 270 top
C18  74.07,22 270 top
C19  42.32,24.54 270 top
C20  43.59,24.54 270 top
C21  44.86,18.19 270 top
C22  46.13,18.19 270 top
C23  44.86,28.35 180 top
C24  44.86,27.08 180 top
C25  95.66,22 90 top
C26  9.3,47.4 90 top
C27  8.03,30.89 90 top
C28  37.24,49.94 90 top
C29  90.58,22 270 top
C30  96.93,35.97 0 top
C31  90.58,35.97 270 top
C32  22,46.13 180 top
C33  28.35,20.73 270 top
C34  28.35,9.3 90 top
C35  9.3,14.38 90 top
C36  57.56,42.32 90 top
C37  58.83,42.32 270 top
C38  65.18,42.32 270 top
C39  47.75,44.55 180 top
C40  72.85,44.04 180 top
C41  77.52,43.64 270 top
C42  81.03,12.65 90 bottom
IC1  63.91,22 270 top
IC2  14.38,41.05 270 top
IC3  14.38,22 270 top
IC4  14.38,8.03 270 top
IC5  5.49,47.4 180 top
IC6  5.49,30.89 180 top
IC7  5.49,14.38 180 top
IC8  39.78,49.94 0 top
IC9  46.13,62.64 0 top
IC10  72.8,48.67 90 top
IC11  32.16,62.64 0 top
IC12  20.73,38.51 180 top
IC13  81.69,48.67 90 top
IC14  20.73,20.73 180 top
IC15  20.73,6.76 180 top
IC16  93.12,22 0 top
IC17  93.12,35.97 0 top
IC18  14.43,44.91 90 top
IC19  14.27,25.81 90 top
IC20  14.43,11.79 90 top
IC21  52.48,39.78 0 top
IC22  75.34,27.08 0 top
IC23  46.13,39.78 90 top
JP1  53.19,50.85 0 top
JP3  1.88,58.27 90 top
JP4  67.16,56.24 0 top
JP5  15.24,62.23 180 top
JP8  15.24,55.88 180 top
JP9  54.61,46.99 0 top
JP10  62.23,44.45 0 top
JP11  59.69,39.37 0 top
JP12  55.88,34.29 0 top
JP13  33.02,34.29 90 top
JP14  34.29,21.59 180 top
R1  74.07,62.64 180 top
R2  66.45,62.64 180 top
R3  6.76,52.48 180 top
R4  5.49,39.78 270 top
R5  5.49,23.27 270 top
R6  5.49,6.76 270 top
R7  5.49,53.75 0 top
R8  82.6,12.75 270 bottom
R10  22.1,44.75 180 top
R11  26.87,20.78 270 top
R12  26.97,9.4 90 top
R14  [R0402]  57.56,15.65 270 top
R15  [R0402]  57.56,20.73 270 top
R16  [R0402]  60.1,15.65 270 top
R17  [R0402]  60.1,20.73 270 top
R18  [R0402]  62.64,15.65 270 top
R19  [R0402]  62.64,20.73 270 top
R20  [R0402]  65.18,15.65 270 top
R21  [R0402]  65.18,20.73 270 top
R22  [R0402]  67.72,15.65 270 top
R23  [R0402]  67.72,20.73 270 top
R24  [R0402]  70.26,15.65 270 top
R25  [R0402]  70.26,20.73 270 top
R26  [R0402]  66.45,15.65 270 bottom
R27  [R0402]  66.45,20.73 270 bottom
R28  [R0402]  56.29,15.65 270 bottom
R29  [R0402]  56.29,20.73 270 bottom
R30  [R0402]  53.75,15.65 270 bottom
R31  [R0402]  53.75,20.73 270 bottom
R32  [R0402]  55.02,15.65 270 top
R33  [R0402]  55.02,20.73 270 top
R34  0  [R0402]  63.91,15.65 270 bottom
R35  0  [R0402]  63.91,20.73 270 bottom
R36  [R0402]  61.37,15.65 270 bottom
R37  [R0402]  61.37,20.73 270 bottom
R38  [R0402]  58.83,15.65 270 bottom
R39  [R0402]  58.83,20.73 270 bottom
R40  [R0402]  71.53,15.65 270 bottom
R41  [R0402]  71.53,20.73 270 bottom
R42  [R0402]  68.99,15.65 270 bottom
R43  [R0402]  68.99,20.73 270 bottom
TP1  22,62.64 0 top
TP2  9.3,62.64 0 top
TP3  22,56.29 0 top
TP4  9.3,56.29 0 top
TP5  38.51,62.64 0 top
TP6  52.48,62.64 0 top
TP7  75.34,39.78 0 top
TP8  68.99,42.32 0 top
TP9  84.23,30.89 0 top
TP10  80.42,35.97 0 top
TP11  25.81,33.43 0 top
TP12  27.08,42.32 0 top
TP13  20.73,30.89 0 top
TP14  27.08,25.81 0 top
TP15  34.7,44.86 0 top
TP16  92.15,29.06 0 top
TP17  38.51,25.81 0 top
TP18  22.5,51 180 top
TP19  13.06,50.9 0 top
TP20  52.48,55.02 0 top
TP21  62.64,48.67 0 top
TP22  37.24,33.43 0 top
TP23  32.16,25.81 0 top
TP24  10.57,34.7 0 top
TP25  11.84,18.19 0 top
TP26  11.84,2.95 0 top
TP27  80.42,60.1 0 top
TP28  58.83,60.1 0 top
TP29  88.49,56.24 90 top
U$2  59.39,8.03 0 top
U$5  49.94,25.81 270 top

### Tracks (layer width: path | path; a pad name or v marks a point on that pad's centre or on a via)
!CS_ADC1
  Top 0.203: 73.36,5.28 73.36,7.5
  Top 0.254: IC22.P$9 84.97,25.98 85.95,24.99 85.95,16.31 85.95,11.38 83.31,8.74 79.45,4.88 73.76,4.88 73.36,5.28 | 73.36,7.5 U$2.V66
!CS_ADC2
  Top 0.254: U$5.P$9 48.84,15.12 48.84,14.7 46.94,12.8 46.94,8.12 U$2.V35
!CS_DAC  (via drill 0.6)
  Top 0.254: IC23.7 39.46,40.28 38.61,39.42 38.61,37.03 v38.56,36.98
  Bottom 0.254: v38.56,36.98 38.56,13.41 38.56,9.8 38.56,9.2 43.69,4.06 44.3,4.06 52.83,4.06 53.44,4.67 53.44,6.42 U$2.V41
AGND  (via drill 0.6)
  Top 0.254: C9.2 C10.2 72.9,32.78 C6.2 70.01,32.88 69.6,32.88 IC1.58 69.56,32.92 69.29,32.92 69.09,32.92 68.68,32.92 68.48,33.12 68.48,33.53 | IC1.32 IC1.33 60.7,27.23 v59.89,27.23 | v70.26,37.59 69.44,37.59 68.93,37.08 IC1.1 IC1.64 68.83,35.91 | IC1.16 IC1.17 59.43,35.91 v59.28,35.76 | IC1.49 IC1.48 68.93,26.93 69.65,26.21 v70.26,26.21
  Top 0.406: R7.2 6.11,53.72 R3.2 6.11,51.81 7.72,50.19 v9.35,50.19 10.06,50.9 TP19.TP | C9.2 77.28,32.78 78.03,33.53 78.03,37.39 80.06,39.42 80.06,45.92 81.69,47.55 81.69,48.16 82.09,48.56 82.89,48.56 IC13.2 | 68.83,35.91 68.48,35.56 68.48,33.53
  Route2 0.406: v9.35,50.19 20.93,50.19 26.42,44.91 50.6,44.91 52.02,43.28 52.02,36.58 52.83,35.76 v59.28,35.76
  pour Route2: 58.32,39.62 58.32,23.98 72.54,24.18 72.54,39.62
AVDD
  Top 0.254: C9.1 C10.1 74.63,34.78 | IC1.62 72.67,34.91 C6.1 | C41.1 78.63,44.29 78.84,44.5
  Top 0.406: C6.1 74.63,34.78 74.63,34.8 78.84,39.01 78.84,40.64 | TP7.TP 77.98,39.78 78.84,40.64 | 78.84,40.64 78.84,44.5 78.84,46.17 IC13.5
BASELINE
  Top 0.254: IC1.56 70.87,31.9 71.12,31.9 71.53,31.5 77.62,31.5 77.83,31.7 78.84,32.72 79.65,32.72 80.47,33.53 80.47,35.92 TP10.TP
CAP_PRECHAR
  Top 0.254: C38.2 65.39,41.67 65.39,41.05 | 65.39,41.05 65.39,40.85 62.43,37.89 IC1.14 | TP21.TP 62.64,48.51 66.04,45.11 66.04,41.7 65.39,41.05
CAP_PRECHAR_1
  Top 0.406: IC21.12 52.79,44.34 50.09,47.04 50.09,50.29 JP1.1
CLK  (via drill 0.6)  (3 unrouted)
  Top 0.254: IC1.20 62.4,34.41 v62.53,34.54
  Bottom 0.254: R30.1 R31.2 | v62.53,34.54 63.35,33.73 63.35,27.43 62.33,26.42 61.11,26.42 57.86,23.16 55.42,23.16 55.02,22.76
CLK_ADC  (via drill 0.6)
  Top 0.254: IC22.P$10 84.53,27.03 85.14,27.03 86.77,25.4 86.77,10.77 | U$2.V65 72.75,6.22 72.75,5.28 72.75,3.86 73.76,2.85 84.12,2.85 86.77,5.49 86.77,10.77 | U$5.P$10 49.89,15.75 v50.19,15.44 | v88.59,12.19 87.58,11.18 87.17,11.18 86.77,10.77
  Route2 0.254: v88.59,12.19 53.44,12.19 v50.19,15.44
CLK_DAC  (via drill 0.6)
  Top 0.254: IC23.10 42.64,38.78 41.25,37.39 41.25,33.68 v41.4,33.53
  Bottom 0.203: 50.8,4.88 50.85,4.88 50.95,4.98 50.95,7.59 U$2.V38
  Bottom 0.254: v41.4,33.53 39.37,31.5 39.37,13.82 39.37,10.21 39.37,9.6 43.89,5.08 44.09,4.88 46.74,4.88 50.8,4.88
CLK_PRECH1  (via drill 0.6)  (1 unrouted)
  Top 0.254: IC1.9 64.93,36.01 65.18,35.76 66.6,35.76 67,35.36 v67,34.75
  Bottom 0.254: R41.2 70.91,20.08 70.26,20.73 70.26,23.16 68.63,24.79 68.63,32.72 67,34.34 v67,34.75
CLK_PRECH1_T
  Bottom 0.254: R40.2 71.53,12.6 72.95,11.18 72.95,10.01 U$2.V32
CLK_PRECH2  (via drill 0.6)  (1 unrouted)
  Top 0.254: IC1.10 64.43,35.7 v65.38,34.75
  Bottom 0.254: R43.2 68.27,20.08 67.82,20.52 67.82,24.79 68.22,25.2 68.22,31.9 v65.38,34.75
CLK_PRECH2_T
  Bottom 0.203: U$2.V29 70.58,11.71 70.51,11.79
  Bottom 0.254: R42.2 68.99,13.31 70.51,11.79
CLK_REF  (via drill 0.6)
  Top 0.254: v18.69,28.45 18.49,28.25 16.46,28.25 15.42,27.2 15.42,26.86 IC19.4 | v19.71,14.43 19.59,14.3 18.04,14.3 17.15,13.41 16.05,13.41 15.47,12.83 IC20.4 | IC18.4 16.6,45.86 v17.48,46.74
  Bottom 0.254: v17.48,46.74 17.48,29.87 | 17.48,29.87 17.48,14.02 | 17.48,14.02 18.29,14.43 v19.71,14.43 | 17.48,14.02 17.48,4.27 18.09,3.66 33.27,3.66 53.57,3.66 55.02,5.11 55.02,6.45 U$2.V43 | v18.69,28.45 18.69,29.26 18.29,29.67 17.68,29.67 17.48,29.87
CLK_T
  Bottom 0.254: R30.2 53.75,14.73 50.6,11.58 U$2.V4
CS_B0  (4 unrouted)
  Top 0.254: 58.88,22.35 59.89,23.37 63.96,23.37 65.18,24.59 65.18,26.42 65.38,26.62 65.38,27.71 IC1.41
CS_B0_T
  Top 0.203: U$2.V9 54.59,11.3 55.07,11.79
  Top 0.254: R14.2 57.56,14.28 55.07,11.79
CS_B1  (4 unrouted)
  Top 0.254: 61.52,22.35 62.13,22.96 64.16,22.96 65.58,24.38 65.58,26.01 65.99,26.42 65.99,27.69 IC1.42
CS_B1_T
  Top 0.254: R16.2 60.1,14.38 57.1,11.38 57.1,10.09 U$2.V12
CS_B2  (4 unrouted)
  Top 0.254: 63.91,22.1 65.99,24.18 65.99,25.81 66.4,26.21 66.4,27.73 IC1.43
CS_B2_T
  Top 0.254: R18.2 62.64,13.36 64.82,11.18 64.82,10.14 U$2.V22
CS_B3  (2 unrouted)
  Top 0.254: R21.2 65.75,20.08 | 66.4,20.73 66.4,25.4 67,26.01 67,27.68 IC1.44
CS_B3_T
  Top 0.203: U$2.V25 67.39,10.85 67.26,10.97
  Top 0.254: R20.2 65.18,13.06 67.26,10.97
CS_B4  (3 unrouted)
  Top 0.254: 68.63,19.51 68.63,24.79 67.41,26.01 67.41,27.74 IC1.45
CS_B4_T
  Top 0.254: R22.2 67.72,13.16 69.49,11.38 69.49,10.27 U$2.V28
CS_B5  (2 unrouted)
  Top 0.254: 70.26,18.9 69.04,20.12 69.04,24.99 68.02,26.01 68.02,27.66 IC1.46
CS_B5_T
  Top 0.203: U$2.V31 72.19,11.13 72.14,11.18
  Top 0.254: R24.2 70.26,13.06 72.14,11.18
CS_REF_1  (via drill 0.6)
  Top 0.254: v15.85,48.16 15.85,47.35 15.65,47.14 14.63,47.14 14.02,46.53 14.02,45.52 13.71,45.21 IC18.6
  Bottom 0.254: v15.85,48.16 15.04,48.16 12.8,45.92 12.8,4.88 16.46,1.22 49.78,1.22 64.34,1.22 67.84,4.72 67.84,6.42 U$2.V59
CS_REF_2  (via drill 0.6)
  Top 0.254: v14.02,28.25 14.02,26.42 13.71,26.11 IC19.6
  Bottom 0.254: v14.02,28.25 13.82,28.25 13.21,27.64 13.21,5.08 16.66,1.63 49.78,1.63 63.09,1.63 66.19,4.72 U$2.V57
CS_REF_3  (via drill 0.6)
  Top 0.254: v14.43,14.22 14.43,13.01 14.43,12.6 13.82,11.99 13.26,11.99 IC20.6
  Bottom 0.203: 65.43,4.85 65.43,7.58 U$2.V56
  Bottom 0.254: v14.43,14.22 13.61,13.41 13.61,5.28 16.87,2.03 33.27,2.03 62.61,2.03 65.43,4.85
DGND  (via drill 0.6)
  Top 0.254: C13.2 C12.2 56.59,27.7 C11.2 57.57,28.65 58.06,28.65 59.82,30.41 IC1.28 61.45,30.41 v62.33,31.29
  Top 0.406: IC10.2 74.15,48.62 76.15,48.62 v76.56,48.21 | R3.1 9.5,52.48 v9.75,52.22 | v83.92,55.68 87.94,55.68 TP29.TP
  Route2 0.406: v9.75,52.22 31.5,52.22 45.11,52.22 56.9,52.22 58.12,51 58.93,50.19 67.06,50.19 68.48,48.77 76,48.77 v76.56,48.21
  Route3 0.406: 76.61,48.16 76.61,46.33 68.07,37.39 66.04,37.39 64.41,35.76 64.41,34.14 63.6,33.33 63.6,31.7 63.2,31.29 v62.33,31.29 | 76.61,48.16 v76.56,48.21 | 76.61,48.16 76.61,51.61 80.67,55.68 v83.92,55.68
DVDD  (via drill 0.6)
  Top 0.254: C13.1 C12.1 55.08,29.06 55.63,29.06 57.13,30.57 C11.1 57.9,30.91 IC1.27 61.34,30.91 61.52,31.09 61.52,32.11 v62.33,32.92 | C40.1 73.5,43.22 72.95,42.67 70.51,42.67 68.89,44.3
  Top 0.406: v68.78,47.8 68.87,47.72 69.7,47.72 | 69.7,47.72 IC10.5 | TP8.TP 68.89,42.32 68.89,44.3 68.89,46.9 69.7,47.72
  Route3 0.406: 68.73,47.8 v68.78,47.8 68.68,47.7 68.68,38.81 67.87,38 65.84,38 63.8,35.97 63.8,34.39 v62.33,32.92
GND  (via drill 0.6)  (34 unrouted)
  Top 0.254: C8.2 C14.2 81.65,22.66 79.76,22.66 78.64,21.54 | C16.2 C15.2 78.64,20.84 78.64,21.54 | C18.2 C17.2 | C23.2 C24.2 44.21,26.25 44.65,25.81 46.99,25.81 U$5.P$3 | C19.2 C20.2 44.29,23.89 45.26,22.91 | U$5.P$6 45.99,22.06 44.04,20.12 44.04,18.35 C21.2 C22.2 | IC22.P$6 78.24,22.14 78.64,21.74 78.64,21.54 | IC22.P$3 75.39,22.67 C18.2 | 74.08,21.34 C18.2 | IC15.4 18.82,10.49 20.32,11.99 24.38,11.99 25.11,12.72 | 25.03,13.25 25.03,18.03 25.03,18.12 25.4,18.49 27.84,18.49 28.45,19.1 28.45,19.98 C33.2 | 25.03,13.25 25.03,12.8 25.11,12.72 | 25.03,13.25 v26.42,14.63 | IC14.4 18.9,23.4 18.9,24.79 20.12,26.01 20.12,26.62 19.71,27.03 17.68,27.03 16.76,26.11 IC19.3 | 13.18,10.77 IC20.8 | 56.69,15.65 54.05,15.65 54.05,20.41 | 54.05,20.41 R33.1 | R17.1 60.1,21.29 | 59.13,16.26 58.52,15.65 60.76,15.65 60.96,15.65 | 61.77,16.46 60.96,15.65 | 54.05,20.41 54.05,22.91 v53.59,23.37 | 64.41,16.46 63.6,15.65 | 63.6,15.65 60.96,15.65 | 66.85,16.46 66.04,15.65 | 66.04,15.65 65.84,15.65 63.6,15.65 | R25.1 71.12,20.52 | 66.04,15.65 70.92,15.65 71.12,15.85 71.12,16.46 71.93,17.27 73.76,17.27 74.57,18.09 | 74.57,20.84 C18.2 | C40.2 72.2,45.52 | 72.2,45.52 72.2,46.08 C5.2 | C41.2 76.49,42.99 74.37,45.11 72.6,45.11 72.2,45.52 | IC23.3 53.39,39.78 | 54.05,42.51 IC21.10 | C34.2 28.35,11.48 27.64,12.19 25.64,12.19 25.11,12.72 | 19.91,45.52 20.12,45.72 | 14.63,11.99 14.73,12.09
  Top 0.406: U$5.P$6 45.26,22.91 44.09,21.74 v42.42,21.74 41.2,22.96 41.2,27.84 41.71,28.35 C23.2 | v27.79,62.43 28.4,61.82 31.24,61.82 32.16,60.91 IC11.2 | v41.96,62.43 42.77,61.62 45.01,61.62 46.13,60.5 IC9.2 | 4.22,54.37 R7.1 2.95,55.64 2.85,55.73 2.79,55.73 | C26.2 9.21,47.95 8.33,47.95 7.72,47.35 5.89,47.35 5.49,47.75 IC5.2 5.49,49.78 5.28,49.99 3.86,49.99 3.25,49.38 | C3.2 2.95,49.07 3.25,49.38 | 4.37,34.85 2.89,36.33 R4.3 4.67,39.06 4.67,40.23 6.91,42.47 | 4.37,34.85 5.49,33.73 IC6.2 5.49,31.5 5.89,31.09 7.58,31.09 C27.2 | C1.2 2.95,33.43 3.35,33.83 | 3.35,33.83 4.37,34.85 | C35.2 9.29,15.04 8.13,15.04 7.52,14.43 6.1,14.43 5.49,15.04 IC7.2 5.49,17.27 4.57,18.19 | 4.57,18.19 2.89,19.87 R5.3 3.25,21.13 3.25,22.35 5.71,24.81 12.19,24.81 | C2.2 2.95,16.56 3.45,17.07 | 3.45,17.07 4.57,18.19 | v1.83,50.19 2.44,50.19 3.25,49.38 | 6.91,42.47 8.3,43.86 13.12,43.86 IC18.8 13.18,43.89 13.82,43.89 14.43,44.5 14.43,44.91 14.73,45.21 IC18.3 19.6,45.21 20.12,45.72 20.52,46.13 C32.2 | IC2.2 8.33,41.05 6.91,42.47 | v2.23,34.54 2.64,34.54 3.35,33.83 | IC3.2 12.75,22 11.79,22.96 11.79,24.4 12.19,24.81 | 8.53,10.84 7.38,10.84 3.05,6.5 3.05,4.88 | 3.05,4.88 3.05,4.42 R6.3 | IC4.2 11.34,8.03 8.53,10.84 | v2.44,17.88 2.64,17.88 3.45,17.07 | v2.03,1.83 2.03,3.86 3.05,4.88 | IC12.4 18.82,42.39 19.91,43.48 19.91,45.52 | 92.86,21.95 91.18,21.95 C29.2 90.02,20.79 v90.02,19.3 | 92.86,21.95 93.12,21.69 IC16.2 | C25.2 94.96,21.95 92.86,21.95 | v81.08,20.32 81.69,20.93 C14.2 | C31.2 91.02,35.76 92.66,35.76 93.12,35.31 IC17.2 93.07,34.62 93.07,33.33 93.27,33.12 96.52,33.12 | C30.2 97.54,35.93 97.54,34.14 96.52,33.12
  Top 0.406: 96.52,33.12 97.33,32.31 v97.33,31.9 | C5.2 71.18,45.16 v70.26,45.16 | C7.2 83.52,51.21 v84.33,52.02 | R2.3 61.78,65.24 61.37,64.82 v61.16,64.82 | C28.2 37.81,50.59 38.61,49.78 39.22,49.78 | 39.22,49.78 42.78,49.78 C4.2 | IC8.2 39.78,49.23 39.22,49.78 | v39.83,54.25 39.83,50.39 39.22,49.78 | 12.19,24.81 IC19.8 13.83,24.81 14.22,25.2 14.22,25.6 14.73,26.11 IC19.3 | IC20.3 14.73,12.09 | 8.53,10.84 11.11,10.84 11.18,10.77 11.19,10.79 IC20.8 | 13.18,10.77 13.82,10.77 14.02,10.77 14.63,11.38 14.63,11.99 | R19.1 62.63,21.38 | R21.1 65.06,21.38 | R23.1 67.3,21.38 66.85,20.93 | C39.1 48.4,45.88 | 48.4,45.88 47.75,46.53 v46.53,46.53 | IC21.13 52.16,43.95 49.78,46.33 48.85,46.33 48.4,45.88 | 53.39,39.78 54.05,40.44 54.05,41.25 | 54.05,41.25 54.05,42.51 | v55.68,40.44 54.86,40.44 54.05,41.25 | IC21.8 55.52,37.03 v56.08,37.59 | TP18.TP 21.13,51 18.69,53.44 8.33,53.44 6.5,55.27 5.69,56.08 3.15,56.08 2.79,55.73 | 2.79,55.73 JP3.1
  Bottom 0.254: 72.34,15.65 73.76,14.22 | 71.53,21.34 71.93,21.34 72.75,20.52 72.75,16.05 72.34,15.65 | R43.1 69.45,21.38 69.7,21.13 69.7,20.52 70.1,20.12 | 70.1,16.26 70.41,15.95 | 70.41,15.95 70.71,15.65 72.34,15.65 | R27.1 66.61,21.38 67.26,20.73 | 67.26,16.26 67.87,15.65 | 67.87,15.65 68.68,15.65 70.1,15.65 70.41,15.95 | R35.1 63.64,21.38 | 67.87,15.65 62.99,15.65 62.79,15.85 62.59,15.65 60.15,15.65 | R39.1 58.56,21.38 | R31.1 53.48,21.38 | 52.83,20.73 52.83,16.05 53.24,15.65 | 57.71,15.65 57.91,15.85 58.12,15.65 60.15,15.65 | 55.47,15.85 55.68,15.65 | 60.55,16.05 60.15,15.65 | 82.5,13.3 R8.1 82.89,13.4
  Bottom 0.305: v73.97,14.22 73.76,14.22
  Bottom 0.406: R35.1 63.84,21.38 | C42.2 82.5,13.3 | 82.89,13.4 83.52,14.02 v83.52,15.44
  pour Route2: 0.2,0.2 98.96,0.2 98.76,23.37 57.71,23.37 57.71,40.23 73.15,40.23 73.15,23.77 98.76,23.77 99.16,67.87 0.2,68.07
  pour Top: 52.43,23.16 52.43,12.19 74.98,12.19 74.98,23.57 52.43,23.57
  pour Bottom: 52.43,23.57 52.43,12.19 74.98,12.19 74.98,23.57
HOLD  (2 unrouted)
HOLD_T
  Bottom 0.254: R38.2 58.83,14.53 55.47,11.18 55.47,10.06 U$2.V10
MUX_DAC_EN  (via drill 0.6)
  Top 0.254: IC21.15 50.89,43.4 50.6,43.69 49.12,43.69 v48.31,42.88
  Bottom 0.203: 49.99,11.99 49.96,11.99 49.81,11.84 49.81,8.85 U$2.V3
  Bottom 0.254: 49.99,11.99 52.17,14.17 52.17,14.43 52.17,25.81 49.73,28.25 49.47,28.53 49.38,28.62 49.38,31.09 49.38,39.17 49.38,41.81 v48.31,42.88
MUX_DAC_SEL  (via drill 0.6)
  Top 0.406: IC21.1 48.15,37.03 v48.11,36.98
  Bottom 0.254: U$2.V1 47.75,9.26 47.75,11.58 50.39,14.22 51.16,14.22 51.77,14.83 51.77,25.6 48.31,29.06 48.31,36.78 v48.11,36.98
MUX_REF_1  (via drill 0.6)
  Top 0.254: IC2.6 14.87,41.7 14.22,41.05 14.22,39.22 v15.65,37.8
  Bottom 0.203: 55.78,4.98 55.78,7.62 U$2.V44
  Bottom 0.254: v15.65,37.8 15.65,37.59 17.07,36.17 17.07,3.86 17.68,3.25 33.27,3.25 54.05,3.25 55.78,4.98
MUX_REF_2  (via drill 0.6)
  Top 0.254: IC3.6 14.72,22.65 14.52,22.65 14.43,22.55 14.43,20.32 v15.85,18.9
  Bottom 0.203: 57.43,5.36 U$2.V46
  Bottom 0.254: v15.85,18.9 15.85,18.69 16.66,17.88 16.66,3.45 17.27,2.85 33.27,2.85 54.91,2.85 57.43,5.36
MUX_REF_3  (via drill 0.6)
  Top 0.254: IC4.6 14.77,8.68 14.22,8.13 14.22,6.91 v15.44,5.69
  Bottom 0.254: v15.44,5.69 15.44,4.06 17.07,2.44 33.27,2.44 55.65,2.44 58.19,4.98 U$2.V47
N$1
  Top 0.254: C36.2 C37.1 58.83,43.99 57.91,44.91 56.69,46.13 55.88,46.94 JP9.2
N$3
  Top 0.254: JP10.1 60.96,42.06 60.56,41.67 C37.2
N$4  (via drill 2.5 pad 2.5)
  other vias: 95.66,4.22
N$5
  Top 0.254: IC4.1 13.49,8.74 13.49,9.42 14.43,10.36 14.85,10.79 IC20.1
N$6
  Top 0.254: C38.1 65.18,44.3 65.18,44.96 64.62,45.52 63.4,46.74 59.94,46.74 58.01,48.67 58.01,51.71 56.49,53.24 55.68,53.24 54.25,53.24 53.44,52.43 53.44,51.1 JP1.2
N$7  (via drill 2.5 pad 2.5)
  other vias: 94.39,63.91
N$8  (via drill 2.5 pad 2.5)
  other vias: 4.22,65.48
N$9
  Route2 0.406: U$2.SHIELD1 45.41,5.59 46.94,4.06 75.79,4.06 77.83,6.1 77.83,7.56 U$2.SHIELD0
  Bottom 0.254: 82.5,12 R8.2 | 77.87,7.52 U$2.SHIELD0
  Bottom 0.406: C42.1 82.5,12 | 77.87,7.52 79.86,7.52 81.69,9.35 82.7,10.36 82.7,12 R8.2
N$17
  Top 0.254: IC2.1 14.06,41.7 14.43,42.06 14.43,43.48 14.83,43.89 15.38,43.89 15.45,43.89 IC18.1
N$19
  Top 0.254: IC3.1 13.43,23.08 14.63,24.28 15.15,24.81 IC19.1
OP_MODE  (via drill 0.6)  (3 unrouted)
  Top 0.254: IC1.11 63.93,33.97 v65.18,32.72
  Bottom 0.254: R27.2 65.83,20.08 | 65.58,32.31 v65.18,32.72
OP_MODE_T
  Bottom 0.254: R26.2 66.45,13.21 68.28,11.38 68.28,10.07 U$2.V26
OUT_S  (4 unrouted)
  Top 0.254: 56.24,22.15 56.64,22.55 57.51,22.55 60.55,25.6 61.32,25.6 62.33,26.62 62.43,26.71 IC1.35
OUT_S_T
  Top 0.254: R32.2 55.02,13.77 52.22,10.97 52.22,10.01 U$2.V6
POT_R1
  Top 0.254: R1.3 71.53,62.74 R1.2
  Top 0.406: TP27.TP 80.36,60.04 R1.2 74.07,58.62 71.53,56.08 69.85,56.08 JP4.3
POT_R2
  Top 0.254: R2.2 68.95,62.54 R2.1 | R2.2 66.45,57.5 | JP4.1 64.62,58.21 R2.2
  Top 0.406: TP28.TP 62.38,56.54 62.69,56.24 JP4.1
POT_R4
  Top 0.254: R4.2 9.96,39.78 | 9.96,39.78 11.53,39.78 12.19,40.44 13.39,40.44 IC2.3 | TP24.TP 10.57,39.17 9.96,39.78
POT_R5
  Top 0.254: R5.2 10.57,23.27 12.39,21.44 | 12.39,21.44 12.8,21.44 13.34,21.44 IC3.3 | TP25.TP 11.99,18.19 11.99,20.73 11.99,21.03 12.39,21.44
POT_R6
  Top 0.254: R6.2 12.19,6.76 | 12.19,6.76 12.81,6.76 IC4.3 | TP26.TP 11.84,6.4 12.19,6.76
REF_ADC  (via drill 0.6)
  Top 0.254: C18.1 C17.1 72.69,22.75 72.69,23.57 | C23.1 C24.1 | C24.1 47.65,27.08 | 47.9,25.79 U$5.P$2 | C24.1 45.51,28.61 44.86,29.26 41,29.26 38.35,26.62 38.35,25.96 TP17.TP
  Top 0.406: 47.9,25.79 47.9,26.82 47.65,27.08 47.3,27.43 v47.3,28.45 | IC22.P$2 74.2,25.08 72.69,23.57 72.69,22.96 71.81,22.07 | 71.81,22.07 71.73,22 | v73.71,18.49 72.9,18.49 71.73,19.66 71.73,19.71 71.73,20.32 71.73,22 | IC17.5 91.52,36.62 C31.1 89.65,36.62 v87.99,34.95 | 71.73,22 71.81,22.07
  Route3 0.406: v47.3,28.45 47.5,28.25 48.16,28.25 50.8,25.6 54.46,25.6 57.1,22.96 70.71,22.96 71.7,21.97 71.7,20.5 v73.71,18.49 73.71,19.46 76.2,21.95 81.28,21.95 87.99,28.65 v87.99,34.95
REFIN_DAC  (1 unrouted)
  Top 0.406: IC8.5 38.83,51.39 38,52.22 35.76,52.22 34.95,51.41 34.95,48.77 | 34.95,48.77 34.95,45.11 TP15.TP | 36.27,47.45 42.88,40.84 43.95,40.84 | 36.27,47.45 34.95,48.77 | C28.1 37.24,48.41 36.27,47.45
RES_BIAS_EXT
  Top 0.254: IC1.6 66.45,36.58 66.45,37.59 67.26,38.41 67.26,40.03 66.65,40.64 66.65,50.39 67.06,50.8 67.06,56.13 JP4.2
RST  (via drill 0.6)  (5 unrouted)
  Top 0.254: IC1.38 63.93,26.24 v63.96,25.4
  Bottom 0.254: 64.57,23.37 64.57,24.79 v63.96,25.4
RST_CSA  (via drill 0.6)  (4 unrouted)
  Top 0.254: IC1.12 63.43,37.26 v64.36,38.2
  Bottom 0.254: 57.66,22.35 61.32,26.01 62.53,26.01 63.75,27.23 63.75,33.53 64.36,34.14 v64.36,38.2
RST_CSA_T
  Bottom 0.203: U$2.V7 52.98,10.69 52.98,11.12 54.25,12.39 54.3,12.45
  Bottom 0.254: R28.2 56.29,14.43 54.3,12.45
RST_T
  Bottom 0.203: U$2.V13 57.78,10.85 58.12,11.18
  Bottom 0.254: R36.2 61.37,14.43 58.12,11.18
SDI_DAC  (via drill 0.6)
  Top 0.254: IC23.9 41.72,39.28 40.03,37.59 40.03,35.41 v39.98,35.36
  Bottom 0.203: U$2.V40 52.63,7.58 52.63,4.98 52.63,4.93 52.17,4.47
  Bottom 0.254: v39.98,35.36 39.78,35.15 39.78,32.92 38.96,32.11 38.96,13.61 38.96,10.01 38.96,9.4 42.06,6.3 43.89,4.47 44.5,4.47 52.02,4.47 52.17,4.47
SDI_REF  (via drill 0.6)
  Top 0.254: v10.97,27.23 11.45,26.76 IC19.5 | v10.97,14.83 13.12,12.89 13.17,12.84 IC20.5 | IC18.5 11.24,45.86 v11.18,45.92
  Bottom 0.203: 64.82,0.81 68.61,4.6 68.61,7.61 U$2.V60
  Bottom 0.254: 11.18,27.03 v10.97,27.23 11.99,27.23 12.39,27.64 | v11.18,45.92 11.38,45.92 12.39,44.91 12.39,27.64 | 12.39,27.64 12.39,14.22 | 12.39,14.22 12.39,4.67 16.26,0.81 49.78,0.81 64.82,0.81 | v10.97,14.83 11.79,14.83 12.39,14.22
SDO_ADC1  (1 unrouted)
  Top 0.254: IC22.P$8 79.94,25.08 84.53,25.08 84.94,24.67 84.94,11.58 81.48,8.13 78.84,5.49 77.03,5.49 U$2.V68
SDO_ADC2
  Top 0.254: U$5.P$8 47.94,15.21 47.94,14.81 46.53,13.41 45.52,13.41 43.08,10.97 43.08,6.5 44.3,5.28 49.99,5.28 50.19,5.49 U$2.V37
SGN  (via drill 0.6)  (4 unrouted)
  Top 0.254: IC1.39 64.43,29.32 v64.57,29.46
  Bottom 0.254: 64.97,28.85 v64.57,29.46
SGN_T
  Bottom 0.203: U$2.V23 65.78,11.43 65.63,11.58
  Bottom 0.254: R34.2 63.91,13.31 65.63,11.58
V0NDAC
  Top 0.254: IC21.5 52.79,36.13 52.63,35.97 52.02,35.97 51.82,35.76 51.41,35.36 51.41,34.14 51,33.73 47.85,33.73 46.69,34.9 46.69,38.76 47.14,39.22 47.19,39.27 48.23,39.27 IC23.2
V0PDAC
  Top 0.254: IC23.1 50.63,38.78 50.89,38.52 IC21.2
V1NDAC
  Top 0.254: IC21.14 51.52,41.16 51.21,40.84 48.31,40.84 IC23.5
V1PDAC
  Top 0.254: IC23.4 52.88,40.28 53.44,40.84 53.44,42.51 IC21.11
V_REF_PRECHAR  (via drill 0.6)
  Top 0.254: v31.29,8.53 31.18,8.65 28.55,8.65 C34.1 28.25,8.55 R12.1 | IC1.7 65.93,39.1 v66.04,39.22
  Bottom 0.254: v31.29,8.53 31.29,35.76 34.54,39.01 44.5,39.01 46.13,40.64 46.13,42.06 46.13,42.88 47.14,43.89 52.43,43.89 52.83,43.48 53.85,42.47 64.82,42.47 66.04,41.25 v66.04,39.22
V_REF_PRECHAR_BUFF
  Top 0.254: R12.2 26.05,11.18 23.77,11.18 21.74,11.18 21.34,10.77 21.34,9.38 IC15.2 21.34,9.33 21.34,7.57 20.09,6.33 20.09,4.7 20.12,4.67 20.12,4.18 IC15.6
VCC  (3 unrouted)
VDD  (via drill 0.6)
  Top 0.254: C16.1 C15.1 76.4,21.55 76.4,23.13 IC22.P$4 | C19.1 C20.1 45.51,25.19 U$5.P$4 | IC18.2 15.47,44.55 15.42,44.5 | IC23.8 45.36,39.78
  Top 0.406: IC5.3 IC5.4 3.89,46.75 C3.1 2.25,46.75 0.81,45.31 0.81,31.5 | IC6.3 IC6.4 3.89,30.24 C1.1 2.91,30.28 2.03,30.28 0.81,31.5 | IC7.3 IC7.4 3.89,13.73 C2.1 | v34.09,62.84 34.47,62.46 34.47,61.57 | 34.47,61.57 IC11.3 | 0.81,31.5 0.81,14.83 1.83,13.82 2.85,13.82 C2.1 | IC2.5 16.46,41.05 17.07,41.66 17.07,42.67 | 17.07,42.67 17.07,43.69 16.26,44.5 16.2,44.55 16.15,44.55 IC18.2 | IC3.5 16.31,22 16.66,22.35 16.66,24.99 16.26,25.4 | IC4.5 15.95,8.03 16.46,8.53 16.46,10.97 16.87,10.97 | v18.69,43.89 18.29,43.89 17.07,42.67 | v18.69,26.01 17.68,26.01 17.07,25.4 16.26,25.4 | 16.87,10.97 17.48,10.97 18.49,11.99 v18.49,13.01 | v2.44,11.58 2.85,11.99 2.85,13.62 C2.1 | TP5.TP 35.53,62.64 34.47,61.57 | v42.42,27.03 42.42,26.36 C20.1 | IC16.3 94.72,21.35 C25.1 96.05,21.74 96.93,21.74 97.74,22.55 v97.74,23.37 96.93,24.18 94.95,24.18 IC16.4 | v76,17.88 77.23,19.11 C16.1 | C30.1 95.37,35.97 IC17.3 IC17.4 95,38.2 v95.5,38.2 | R1.1 79.24,65.24 v80.06,64.41 | IC8.4 42.94,51.24 43.86,51.24 44.09,51 44.09,50.08 C4.1 44.09,49.79 44.09,48.97 43.76,48.64 42.67,48.64 | IC8.3 42.67,48.64 | v43.48,46.53 43.48,47.82 42.67,48.64 | IC19.2 16.2,25.46 16.26,25.4 | 45.72,39.42 45.72,38 44.5,36.78 v43.48,36.78 | 45.72,39.42 45.72,40.44 | 45.72,40.44 45.72,43.17 C39.2 | 45.36,39.78 45.72,39.42 | IC21.16 50.25,42.33 49.38,41.45 46.74,41.45 45.72,40.44 | IC20.2 16.4,11.44 16.87,10.97
  pour Route3: 0.2,68.07 0.2,0.2 98.96,0.2 98.76,13.61 99.16,67.87
VDD2  (via drill 0.6)
  Top 0.406: TP6.TP 52.43,62.59 50.39,62.59 48.44,60.63 IC9.3 50.8,59.54 v51.82,58.52 | 72.9,49.62 IC10.3 IC13.4 | 72.9,49.62 IC10.4 70.31,50.8 v69.09,50.8 | C5.1 72.9,46.67 72.9,49.62 | C7.1 81.04,50.27 IC13.4 | IC13.3 IC13.4
  Route3 0.406: v51.82,58.52 53.85,58.52 61.57,50.8 v69.09,50.8
VDD_REF_1
  Top 0.254: IC5.5 7.55,46.1 9.14,44.5 13.11,44.5 IC18.7 | R4.1 5.5,42.28 6.3,43.08 6.3,45.96 IC5.5 | C26.1 7.09,46.75 IC5.5
VDD_REF_2
  Top 0.254: R5.1 2.95,25.7 4.88,25.7 6.44,27.26 IC6.5 7.09,30.24 C27.1 8.13,30.14 8.13,27.53 10.21,25.46 IC19.7
VDD_REF_3
  Top 0.254: R6.1 4.38,9.26 6.5,11.38 6.5,13.01 IC7.5 7.09,13.73 C35.1 9.64,13.73 11.79,11.58 11.93,11.44 IC20.7
VDD_SUPPLY_1
  Top 0.406: 20.52,59.54 18.9,59.54 18.29,59.54 16.51,61.32 JP5.1 | 20.52,59.54 IC11.1 | TP1.TP 22,61.01 20.52,59.54
VDD_SUPPLY_2
  Top 0.406: 22.96,58.32 19.3,58.32 18.09,58.32 16.51,56.74 JP8.1 | 22.96,58.32 25.81,58.32 28.04,56.08 40.36,56.08 IC9.1 43.64,59.36 43.64,59.13 | TP3.TP 22,57.35 22.96,58.32
VDD_SUPPLY_IN_1  (via drill 0.6)
  Top 0.406: 8.53,60.76 5.49,60.76 1.93,60.76 JP3.3 | 8.53,60.76 12.55,60.76 12.55,60.81 JP5.2 | TP2.TP 9.3,61.52 8.53,60.76 | IC12.7 21.36,37.82 21.95,38.41 v23.98,38.41 | IC14.7 21.36,17.25 v23.37,15.24 | IC15.7 21.36,5.92 21.95,6.5 24.59,6.5 v25.81,5.28
  Route3 0.406: v25.81,5.28 24.59,6.5 24.59,13.01 23.37,14.22 v23.37,15.24 23.37,15.44 24.59,16.66 24.59,37.8 v23.98,38.41 23.98,52.63 18.09,58.52 16.05,58.52 15.85,58.52 14.83,59.54 14.02,60.35 14.02,62.18 JP5.2
VDD_SUPPLY_IN_2
  Top 0.406: 9.96,58.42 3.35,58.42 2.03,58.42 JP3.2 | 9.96,58.42 10.87,58.42 11.43,58.42 JP8.2 | TP4.TP 9.3,57.76 9.96,58.42
VI+_FIL
  Top 0.254: JP11.2 60.96,38.41 60.15,37.59 58.93,37.59 58.12,36.78 58.12,35.36 60.07,33.41 IC1.22
VI+_FIL_DAC
  Top 0.254: JP11.1 56.84,39.37 56.49,39.01 52.63,39.01 52.22,38.61 52.22,37.09 IC21.4
VI-_FIL
  Top 0.254: IC1.23 58.53,32.91 JP12.2
VI-_FIL_DAC
  Top 0.254: IC21.7 54.06,34.84 JP12.1
VICM  (via drill 0.6)
  Top 0.254: IC1.40 64.93,28.4 65.38,28.85 66.19,28.85 v66.8,29.46 | TP12.TP 24.79,42.32 24.51,42.6 | v26.62,39.01 26.42,39.01 24.59,40.84 24.59,41.5 24.59,42.52 24.51,42.6 | IC21.6 53.44,37.01 53.44,35.56 52.83,34.95 v52.43,34.95 | IC21.3 51.52,36.4 51.52,36.28 51,35.76 50.19,35.76 49.99,35.56 v49.99,34.95 | C32.1 22.95,46.02 R10.1 23.11,44.76 24.38,43.48 24.38,42.72 24.51,42.6
  Route3 0.254: v66.8,29.46 66.04,28.7 66.04,26.62 65.84,26.82 61.37,26.82 60.55,27.64 59.94,28.25 59.33,28.25 55.98,31.6 55.68,31.9 51.82,31.9 | v26.62,39.01 28.04,39.01 34.34,32.72 39.42,32.72 40.23,31.9 46.94,31.9 51.82,31.9 | v49.99,34.95 v52.43,34.95 52.43,32.51 51.82,31.9
VICM_BUFF
  Top 0.254: IC12.6 19.91,36.08 19.91,36.37 20.09,36.55 20.09,38.18 21.34,39.42 21.34,41.08 IC12.2 21.25,41.22 R10.2
VICM_MUX
  Top 0.254: IC2.4 15.89,40.4 17.27,39.01 18.09,39.01 | 18.09,39.01 19.51,39.01 20.12,39.62 20.12,41.08 IC12.3 | 26.98,33.33 TP11.TP 25.7,33.33 18.49,33.33 17.27,34.54 17.27,37.39 17.88,38 17.88,38.81 18.09,39.01
VIN_CSA
  Top 0.254: IC1.15 61.92,38 61.92,38.35 61.98,38.41 63.8,40.23 64.01,40.44 64.01,41.1 64.36,41.45 64.36,41.86 64.36,43.59 JP10.2 63.5,45.41 62.99,45.92 59.54,45.92 57.1,48.36 57.1,49.48 JP1.3 54.05,49.17 52.63,49.17 51.92,49.89 51.92,52.43 52.48,52.98 52.48,53.75 TP20.TP
VIN_CSA_1
  Top 0.254: 54.7,45.31 54.7,43.27 54.7,43.08 IC21.9 | 54.7,45.31 54.7,45.63 JP9.1 | 54.7,45.31 56.49,43.52 56.49,42.06 56.9,41.66 57.55,41.66 C36.1
VL_ADC  (via drill 0.6)
  Top 0.254: C21.1 C22.1 46.13,20.95 U$5.P$7
  Top 0.406: C21.1 46.95,18.84 47.3,18.49 47.3,16.05 v46.69,15.44 | IC22.P$7 81.43,24.18 C14.1 C8.1 83.58,23.92 83.92,23.57 v83.92,20.32 | v88.39,22.76 90.46,22.76 C29.1 91.23,23.3 IC16.5 92.15,23.31 TP16.TP
  Route3 0.406: v46.69,15.44 49.12,17.88 71.32,17.88 72.95,16.26 79.86,16.26 v83.92,20.32 85.95,20.32 v88.39,22.76
VO+_BP_FIL
  Top 0.254: IC1.24 56.33,32.41 42.11,32.41 41,31.29 35.56,31.29 33.83,33.02 JP13.1
VO+_BP_FIL_TEST
  Top 0.254: JP13.2 35.1,35.56 TP22.TP
VO+_CH
  Top 0.254: IC22.P$12 76.4,27.06 76.4,27.84 75.79,28.45 72.29,28.45 72.14,28.45 72.08,28.45 71.63,28.91 69.53,28.91 IC1.50
VO+_FIL
  Top 0.254: IC1.30 60.62,29.41 59.79,29.41 59.08,28.7 59.08,28.65 59.08,27.99 58.52,27.43 58.52,26.62 57.91,26.01 52.43,26.01 51.21,24.79 49.97,24.79 U$5.P$12
VO-_BP_FIL
  Top 0.254: IC1.25 56.44,31.91 42.68,31.91 40.44,29.67 36.78,29.67 35.56,28.45 35.56,23.16 JP14.1
VO-_BP_FIL_TEST
  Top 0.254: JP14.2 33.02,24.94 TP23.TP
VO-_CH  (via drill 0.6)
  Top 0.254: v71.48,27.64 74.37,27.64 74.98,27.03 74.98,26.38 IC22.P$1 | v73.1,29.67 72.69,29.67 72.49,29.87 69.61,29.87 IC1.52
  Bottom 0.254: v73.1,29.67 73.1,29.26 v71.48,27.64
VO-_FIL  (via drill 0.6)
  Top 0.254: IC1.31 61.77,28.91 v62.33,29.46 | v51.77,27.84 50.92,27.84 U$5.P$1
  Bottom 0.254: v51.77,27.84 52.78,27.84 53.39,28.45 59.69,28.45 60.1,28.85 61.72,28.85 v62.33,29.46
VOCM  (via drill 0.6)  (1 unrouted)
  Top 0.254: IC1.36 62.93,28.31 62.74,28.5 62.08,28.5 61.92,28.35 61.92,27.84 61.92,27.03 61.92,26.98 61.16,26.21 59.54,26.21 58.73,25.4 58.12,25.4 53.85,25.4 52.43,23.98 51.21,22.76 51.21,21.54 51,21.34 v50.8,21.34 | v41.05,19.51 40.84,19.3 30.89,19.3 28.81,21.38 C33.1 | R11.1 28.3,21.43 C33.1 | C33.1 28.35,24.54 TP14.TP
  Bottom 0.254: v41.05,19.51 42.47,19.51 43.48,20.52 49.99,20.52 v50.8,21.34
VOCM_1
  Top 0.254: IC4.4 19.16,7.38 20.12,8.33 20.12,9.33 IC15.3
VOCM_BUFF
  Top 0.254: 21.34,21.79 20.09,20.55 IC14.6 | 21.34,21.79 21.34,23.3 IC14.2 | 21.34,21.79 21.75,21.38 21.75,20.51 22.15,20.12 26.86,20.12 R11.2
VOCM_MUX
  Top 0.254: IC3.4 19.11,21.35 20.12,22.35 20.12,23.3 IC14.3 20.09,24.97 20.73,25.6 TP13.TP
VOUT_CSA
  Top 0.254: IC1.54 69.6,30.89 TP9.TP
VU  (3 unrouted)
(copper drawn outside any net)
  shapes: Top area x2

### Text on the board
tNames: TP2 | JP5 | TP1 | TP5 | TP6 | JP3 | TP28 | TP27 | 5V | VDD_IN1 | VDD_1 | VDD | VDD2 | 3.3V | TP4 | JP8 | TP3 | POT_R2 | 1 | POT_R1 | TP20 | GND | R7 | VDD_IN2 | VDD_2 | Vin_csa | R3 | JP4 | TP19 | 3.3V | JP1 | 1.8V | C7 | TP18 | C4 | IC5 | AGND | GND | TP21 | IC10 | C28 | 1 | C26 | IC18 | C32 | C5 | IC13 | 1.8V | C3 | TP15 | IC8 | V_ref_prechar | C39 | 1.8V | TP12 | JP9 | C37 | R10 | C40 | C41 | IC-UC | WAC-11/2014 | REFIN_DAC | JP10 | C36 | Vicm | C38 | TP8 | TP7 | IC12 | AVDD | DVDD | IC17 | JP13 | JP11 | TP24 | C6 | TP10 | C31 | TP11 | TP22 | IC6 | IC1 | baseline | C30 | TP13 | 3.3V | POT_R4 | JP12 | C10 | C9 | TP9 | Vicm_mux | vo+_bp_fil | C1 | Vocm_mux | C23 | C11 | THE / BEAN2 | TP16 | C27 | C24 | IC22 | Vout_csa | 1.8V | TP14 | TP23 | TP17 | VL_ADC | C8 | C14 | 3.3V | IC19 | VREF / ADC | C13 | C12 | C17 | C18 | Vocm | vo-_bp_fil | IC23 | IC14 | C29 | TP25 | C20 | R11 | C33 | C25 | JP14 | C19 | C15 | IC16 | IC7 | C16 | POT_R5 | C42 | R8 | C2 | C35 | 1.8V | C21 | C22 | IC20 | IC15 | TP26 | R12 | C34 | POT_R6